# Altium project Passive_Sonar_Rev3.PrjPcb
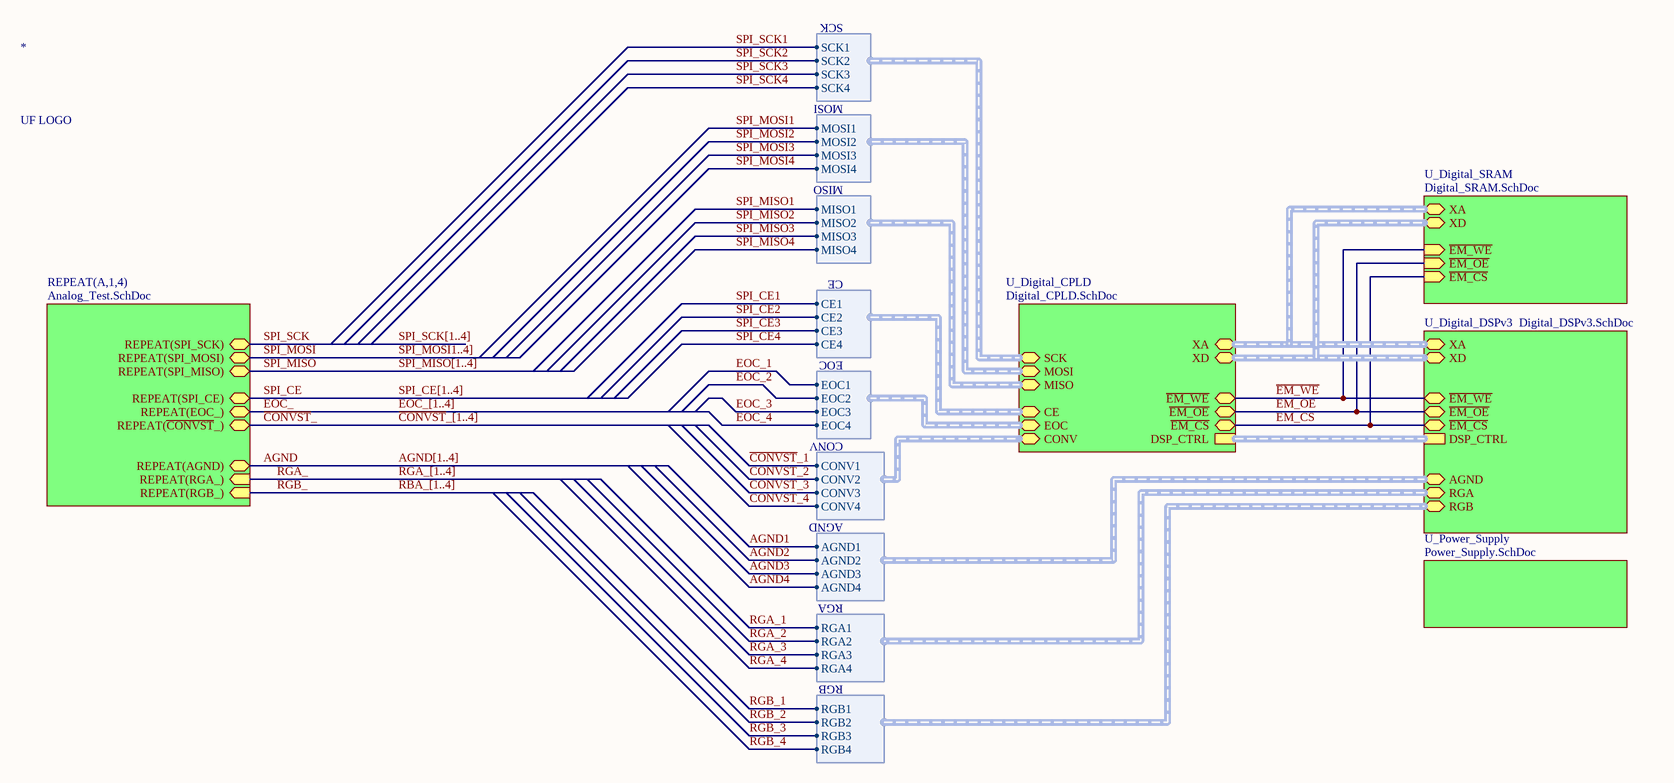
[diagram p0: Top_Level_3.SchDoc]
6 sheets, 245 parts. Net scope: hierarchical (ports join the sheet entries above them; power ports are global).
Board file: Board_Design.PcbDoc
Sheets:
  Top_Level_3.SchDoc
    A1 = Analog_Test.SchDoc
    A2 = Analog_Test.SchDoc
    A3 = Analog_Test.SchDoc
    A4 = Analog_Test.SchDoc
    U_Power_Supply = Power_Supply.SchDoc
    U_Digital_DSPv3 = Digital_DSPv3.SchDoc
    U_Digital_SRAM = Digital_SRAM.SchDoc
    U_Digital_CPLD = Digital_CPLD.SchDoc

## Sheet Top_Level_3.SchDoc
size 381 x 241 mm

### Parts
*  UF LOGO  [UF LOGO-1000]
MIL  MIL LOGO  [MIL LOGO - 500]  (value not drawn)

### Sub-sheets
REPEAT(A,1,4) = Analog_Test.SchDoc: REPEAT(RGA_) (in), REPEAT(RGB_) (in), REPEAT(SPI_SCK) (bidir), REPEAT(SPI_MISO) (bidir), REPEAT(SPI_CE) (bidir), REPEAT(~{CONVST}_) (bidir), REPEAT(EOC_) (bidir), REPEAT(AGND) (bidir), REPEAT(SPI_MOSI) (bidir)
U_Digital_CPLD = Digital_CPLD.SchDoc: ~{EM_OE} (bidir), ~{EM_CS} (bidir), ~{EM_WE} (bidir), DSP_CTRL (harness DSP_CTRL), XA (harness XA), XD (harness XD), SCK (harness SCK), MOSI (harness MOSI), MISO (harness MISO), CE (harness CE), EOC (harness EOC), CONV (harness CONV)
U_Digital_DSPv3 = Digital_DSPv3.SchDoc: ~{EM_WE} (bidir), ~{EM_OE} (bidir), ~{EM_CS} (bidir), DSP_CTRL (harness DSP_CTRL), XA (harness XA), XD (harness XD), AGND (harness AGND), RGA (harness RGA), RGB (harness RGB)
U_Digital_SRAM = Digital_SRAM.SchDoc: ~{EM_CS} (in), ~{EM_WE} (in), ~{EM_OE} (in), XD (harness XD), XA (harness XA)
U_Power_Supply = Power_Supply.SchDoc: no entries

### Harnesses
SCK: SCK1, SCK2, SCK3, SCK4
MOSI: MOSI1, MOSI2, MOSI3, MOSI4
MISO: MISO1, MISO2, MISO3, MISO4
CE: CE1, CE2, CE3, CE4
EOC: EOC1, EOC2, EOC3, EOC4
CONV: CONV1, CONV2, CONV3, CONV4
AGND: AGND1, AGND2, AGND3, AGND4
RGA: RGA1, RGA2, RGA3, RGA4
RGB: RGB1, RGB2, RGB3, RGB4

### Nets
AGND: sheet REPEAT(A,1,4)/REPEAT(AGND)
~{CONVST}_: sheet REPEAT(A,1,4)/REPEAT(~{CONVST}_)
~{EM_CS}: sheet U_Digital_DSPv3/~{EM_CS}, sheet U_Digital_SRAM/~{EM_CS}, sheet U_Digital_CPLD/~{EM_CS}
~{EM_OE}: sheet U_Digital_DSPv3/~{EM_OE}, sheet U_Digital_SRAM/~{EM_OE}, sheet U_Digital_CPLD/~{EM_OE}
~{EM_WE}: sheet U_Digital_DSPv3/~{EM_WE}, sheet U_Digital_SRAM/~{EM_WE}, sheet U_Digital_CPLD/~{EM_WE}
EOC_: sheet REPEAT(A,1,4)/REPEAT(EOC_)
RGA_: sheet REPEAT(A,1,4)/REPEAT(RGA_)
RGB_: sheet REPEAT(A,1,4)/REPEAT(RGB_)
SPI_CE: sheet REPEAT(A,1,4)/REPEAT(SPI_CE)
SPI_MISO: sheet REPEAT(A,1,4)/REPEAT(SPI_MISO)
SPI_MOSI: sheet REPEAT(A,1,4)/REPEAT(SPI_MOSI)
SPI_SCK: sheet REPEAT(A,1,4)/REPEAT(SPI_SCK)

### Buses and harness runs
bus AGND[1..4]
bus EOC_[1..4]
bus RBA_[1..4]
bus RGA_[1..4]
bus SPI_CE[1..4]
bus SPI_MISO[1..4]
bus SPI_MOSI1..4]
bus SPI_SCK[1..4]
bus ~{CONVST}_[1..4]
harness sheet U_Digital_CPLD/DSP_CTRL = sheet U_Digital_DSPv3/DSP_CTRL
harness sheet U_Digital_CPLD/XA = sheet U_Digital_DSPv3/XA = sheet U_Digital_SRAM/XA
harness sheet U_Digital_CPLD/XD = sheet U_Digital_DSPv3/XD = sheet U_Digital_SRAM/XD

## Sheet Analog_Test.SchDoc
size A
Used 4 times, as channels A1, A2, A3, A4. Parts and nets are listed once, with the designators drawn on the sheet.
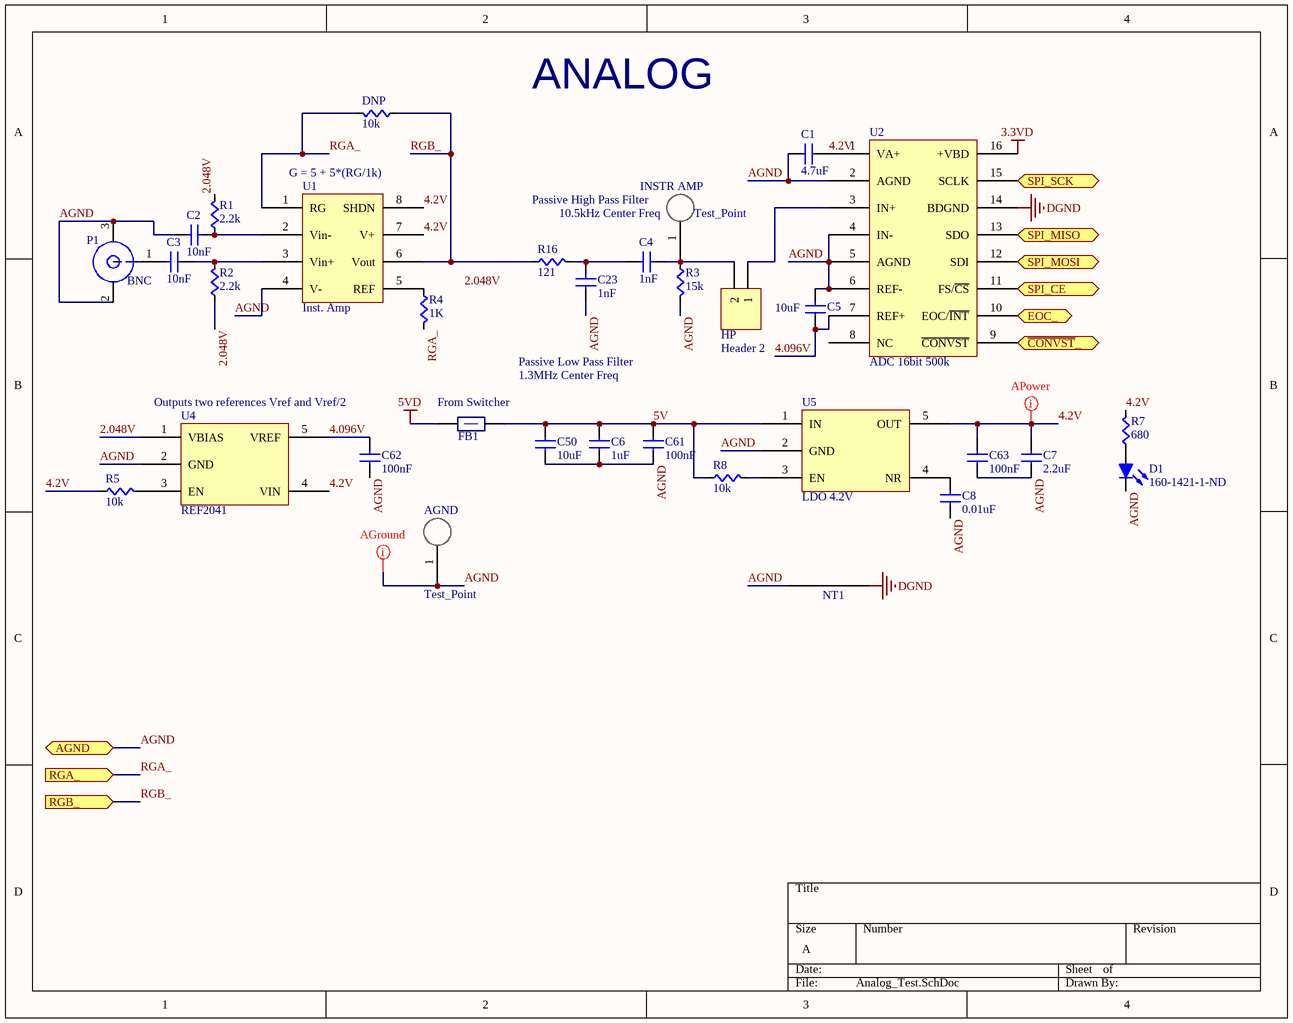
[diagram p1: Analog_Test.SchDoc]

### Parts
AGND  Test_Point  [TP]
C1  value 4.7uF  [CAPC0603]  (hidden comment: Cap)
C2  value 10nF  [CAPC0603]  (hidden comment: Cap)
C3  value 10nF  [CAPC0603]  (hidden comment: Cap)
C4  value 1nF  [CAPC0603]  (hidden comment: Cap)
C5  value 10uF  [CAPC0603]  (hidden comment: Cap)
C6  value 1uF  [CAPC0603]  (hidden comment: Cap)
C7  value 2.2uF  [CAPC0603]  (hidden comment: Cap)
C8  value 0.01uF  [CAPC0603]  (hidden comment: Cap)
C23  value 1nF  [CAPC0603]  (hidden comment: Cap)
C50  value 10uF  [CAPC0603]  (hidden comment: Cap)
C61  value 100nF  [CAPC0603]  (hidden comment: Cap)
C62  value 100nF  [CAPC0603]  (hidden comment: Cap)
C63  value 100nF  [CAPC0603]  (hidden comment: Cap)
D1  Supplier Part Number: 160-1421-1-ND  [LED0805-RED]  (hidden comment: LED-RED)
DNP  value 10k  [RES0603]  (hidden comment: Res)
FB1  FBead  [RES0603]  (value not drawn)
HP  Header 2  [HDR1X2]
INSTR_AMP  Test_Point  [TP]
NT1  NetTie  [NT_5mil]  (value not drawn)  (net tie, no BOM)
P1  BNC  [BNC Connector]
R1  value 2.2k  [RES0603]  (hidden comment: Res)
R2  value 2.2k  [RES0603]  (hidden comment: Res)
R3  value 15k  [RES0603]  (hidden comment: Res)
R4  value 1K  [RES0603]  (hidden comment: Res)
R5  value 10k  [RES0603]  (hidden comment: Res)
R7  value 680  [RES0603]  (hidden comment: Res)
R8  value 10k  [RES0603]  (hidden comment: Res)
R16  value 121  [RES0603]  (hidden comment: Res)
U1  Inst. Amp  [TSSOP-8n]
U2  ADC 16bit 500k  [TSSOP-16pin]
U4  REF2041  [SOT23-5]
U5  LDO 4.2V  [sot23-5]

### Ports
AGND (bidir), EOC_ (bidir), RGA_ (in), RGB_ (in), SPI_CE (bidir), SPI_MISO (bidir), SPI_MOSI (bidir), SPI_SCK (bidir), ~{CONVST}_ (bidir)

### Nets
3.3VD: U2.16(+VBD)
5VD: FB1.1(A)
DGND: NT1.2 U2.14(BDGND)
2.048V: R1.1(A) R2.2(B) U4.1(VBIAS)
4.2V: C1.2(B) C7.2(B) C63.1(A) R5.2(B) R7.1(A) U1.7(V+) U1.8(SHDN) U2.1(VA+) U4.4(VIN) U5.5(OUT)
4.096V: C5.2(B) C62.1(A) U2.7(REF+) U4.5(VREF)
5V: C6.2(B) C50.1(A) C61.1(A) FB1.2(B) R8.2(B) U5.1(IN)
AGND: AGND.1 C1.1(A) C2.1(A) C5.1(A) C6.1(A) C7.1(A) C8.1(A) C23.1(A) C50.2(B) C61.2(B) C62.2(B) C63.2(B) D1.1(K) NT1.1 P1.2(GND) P1.3(GND) R3.1(A) U1.4(V-) U2.2(AGND) U2.4(IN-) U2.5(AGND) U2.6(REF-) U4.2(GND) U5.2(GND) ; port AGND
~{CONVST}_: U2.9(~{CONVST}) ; port ~{CONVST}_
EOC_: U2.10(EOC/~{INT}) ; port EOC_
RGA_: DNP.1(A) R4.1(A) U1.1(RG) ; port RGA_
RGB_: DNP.2(B) R16.2(B) U1.6(Vout) ; port RGB_
SPI_CE: U2.11(FS/~{CS}) ; port SPI_CE
SPI_MISO: U2.13(SDO) ; port SPI_MISO
SPI_MOSI: U2.12(SDI) ; port SPI_MOSI
SPI_SCK: U2.15(SCLK) ; port SPI_SCK
NetC2_2: C2.2(B) R1.2(B) U1.2(Vin-)
NetC3_1: C3.1(A) P1.1(Signal)
NetC3_2: C3.2(B) R2.1(A) U1.3(Vin+)
NetC4_1: C4.1(A) C23.2(B) R16.1(A)
NetC4_2: C4.2(B) HP.2 INSTR_AMP.1 R3.2(B)
NetC8_2: C8.2(B) U5.4(NR)
NetD1_2: D1.2(A) R7.2(B)
NetHP_1: HP.1 U2.3(IN+)
NetR4_2: R4.2(B) U1.5(REF)
NetR5_1: R5.1(A) U4.3(EN)
NetR8_1: R8.1(A) U5.3(EN)

Not connected (* = marked no-connect by the designer): U2 8(NC)

### Channels
A1: designators AGND=AGND_A1 C1=C1_A1 C2=C2_A1 C3=C3_A1 C4=C4_A1 C5=C5_A1 C6=C6_A1 C7=C7_A1 C8=C8_A1 C23=C23_A1 C50=C50_A1 C61=C61_A1 C62=C62_A1 C63=C63_A1 D1=D1_A1 DNP=DNP_A1 FB1=FB1_A1 HP=HP_A1 INSTR AMP=INSTR_AMP_A1 NT1=NT1_A1 P1=P1_A1 R1=R1_A1 R2=R2_A1 R3=R3_A1 R4=R4_A1 R5=R5_A1 R7=R7_A1 R8=R8_A1 R16=R16_A1 U1=U1_A1 U2=U2_A1 U4=U4_A1 U5=U5_A1; ports AGND=AGND EOC_=EOC_1 RGA_=RGA_ RGB_=RGB_ SPI_CE=SPI_CE1 SPI_MISO=SPI_MISO1 SPI_MOSI=SPI_MOSI1 SPI_SCK=SPI_SCK1 ~{CONVST}_=~{CONVST}_1
A2: designators AGND=AGND_A2 C1=C1_A2 C2=C2_A2 C3=C3_A2 C4=C4_A2 C5=C5_A2 C6=C6_A2 C7=C7_A2 C8=C8_A2 C23=C23_A2 C50=C50_A2 C61=C61_A2 C62=C62_A2 C63=C63_A2 D1=D1_A2 DNP=DNP_A2 FB1=FB1_A2 HP=HP_A2 INSTR AMP=INSTR_AMP_A2 NT1=NT1_A2 P1=P1_A2 R1=R1_A2 R2=R2_A2 R3=R3_A2 R4=R4_A2 R5=R5_A2 R7=R7_A2 R8=R8_A2 R16=R16_A2 U1=U1_A2 U2=U2_A2 U4=U4_A2 U5=U5_A2; ports AGND=AGND EOC_=EOC_2 RGA_=RGA_ RGB_=RGB_ SPI_CE=SPI_CE2 SPI_MISO=SPI_MISO2 SPI_MOSI=SPI_MOSI2 SPI_SCK=SPI_SCK2 ~{CONVST}_=~{CONVST}_2
A3: designators AGND=AGND_A3 C1=C1_A3 C2=C2_A3 C3=C3_A3 C4=C4_A3 C5=C5_A3 C6=C6_A3 C7=C7_A3 C8=C8_A3 C23=C23_A3 C50=C50_A3 C61=C61_A3 C62=C62_A3 C63=C63_A3 D1=D1_A3 DNP=DNP_A3 FB1=FB1_A3 HP=HP_A3 INSTR AMP=INSTR_AMP_A3 NT1=NT1_A3 P1=P1_A3 R1=R1_A3 R2=R2_A3 R3=R3_A3 R4=R4_A3 R5=R5_A3 R7=R7_A3 R8=R8_A3 R16=R16_A3 U1=U1_A3 U2=U2_A3 U4=U4_A3 U5=U5_A3; ports AGND=AGND EOC_=EOC_3 RGA_=RGA_ RGB_=RGB_ SPI_CE=SPI_CE3 SPI_MISO=SPI_MISO3 SPI_MOSI=SPI_MOSI3 SPI_SCK=SPI_SCK3 ~{CONVST}_=~{CONVST}_3
A4: designators AGND=AGND_A4 C1=C1_A4 C2=C2_A4 C3=C3_A4 C4=C4_A4 C5=C5_A4 C6=C6_A4 C7=C7_A4 C8=C8_A4 C23=C23_A4 C50=C50_A4 C61=C61_A4 C62=C62_A4 C63=C63_A4 D1=D1_A4 DNP=DNP_A4 FB1=FB1_A4 HP=HP_A4 INSTR AMP=INSTR_AMP_A4 NT1=NT1_A4 P1=P1_A4 R1=R1_A4 R2=R2_A4 R3=R3_A4 R4=R4_A4 R5=R5_A4 R7=R7_A4 R8=R8_A4 R16=R16_A4 U1=U1_A4 U2=U2_A4 U4=U4_A4 U5=U5_A4; ports AGND=AGND EOC_=EOC_4 RGA_=RGA_ RGB_=RGB_ SPI_CE=SPI_CE4 SPI_MISO=SPI_MISO4 SPI_MOSI=SPI_MOSI4 SPI_SCK=SPI_SCK4 ~{CONVST}_=~{CONVST}_4

### Layout directives
net class AGround: AGND
net class APower: 4.2V_A1

### Notes on the sheet
- ANALOG
- (near U1) G = 5 + 5*(RG/1k)
- (near INSTR_AMP) Passive High Pass Filter
- (near INSTR_AMP) 10.5kHz Center Freq
- Passive Low Pass Filter
- Outputs two references Vref and Vref/2
- (near FB1) From Switcher
- 1.3MHz Center Freq
- Labels drawn without touching a wire or pin: 2.048V

### Library data of the parts
AGND INSTR_AMP = Test_Point: TEST POINT PC COMPACT .063"D; Supplier 1: Digi-Key; Supplier Part Number 1: 5006K-ND
D1 = LED-RED: Light Emitting Diode - RED; Manufacturer Part Number: LTST-C171CKT; Manufacturer: Lite-On Inc; Voltage - Forward (Vf) Typ: 1.8V; Current - Test: 20mA; Millicandela Rating: 25mcd; Viewing Angle: 130°; Color: Red; Supplier: Digi-Key; Package / Case: 0805 (2012 Metric)
FB1 = FBead: Ferrite Bead; Supplier 1: Digi-Key; Supplier Part Number 1: 445-2988-1-ND
HP = Header 2: Header, 2-Pin; LatestRevisionDate: 17-Jul-2002; LatestRevisionNote: Re-released for DXP Platform.; Publisher: Altium Limited
NT1 = NetTie: Ties two nets together
P1 = BNC Connector: CONN BNC JACK R/A 50 OHM PCB; Suplier 1: Digi-Key; Supplier Part Number 1: WM5524-ND
U1 = INA331: IC OPAMP INSTR 2MHZ RRO 8VSSOP; Suplier Part Number 1: 296-12202-1-ND; Supplier 1: Digi-Key
U2 = ADC 16bit 500k: IC ADC 16BIT 500KSPS 16-TSSOP; Supplier 1: Digi-Key; Supplier Part Number 1: 296-19764-ND
U4 = REF2041: IC VREF SERIES 2.05V/4.096V 5SOT; Supplier 1: Digi-Key; Supplier Part Number 1: 296-38497-1-ND
U5 = LDO 4.2V 200mA: IC REG LDO 4.2V 0.2A 5SOT; Supplier 1: Digi-Key; Supplier Part Number 1: 296-32585-1-ND
C1-C8 C23 C50 C61-C63 = Cap: Supplier 1: Digi-Key; Supplier Part Number 1: 1276-1000-1-ND
DNP R1-R5 R7 R8 R16 = Res: Supplier 1: Digi-Key; Supplier Part Number 1: RMCF0603JT10K0CT-ND

## Sheet Power_Supply.SchDoc
size A
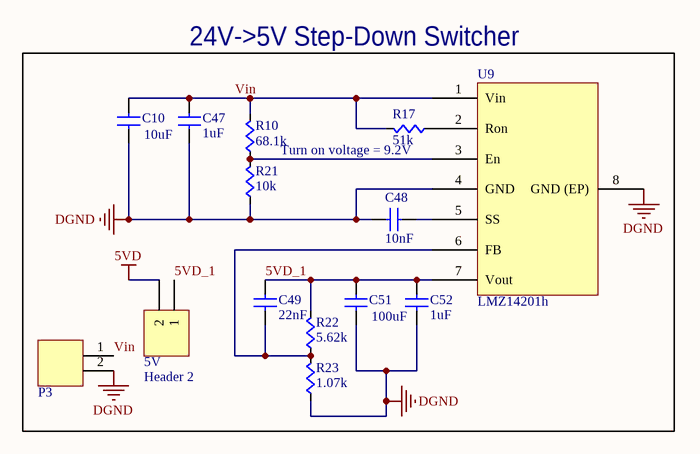
[diagram p2: Power_Supply.SchDoc]

### Parts
5V  Header 2  [HDR1X2]
C10  value 10uF  [CAP1210]  (hidden comment: CAP1210)
C47  value 1uF  [CAP1206]  (hidden comment: Cap1206)
C48  value 10nF  [CAPC0603]  (hidden comment: Cap)
C49  value 22nF  [CAPC0603]  (hidden comment: Cap)
C51  value 100uF  [CAP1210]  (hidden comment: CAP1210)
C52  value 1uF  [CAP1206]  (hidden comment: Cap1206)
P3  2-pin Horz Sherlock  [MOLEX-HDR-1X2-SHERLOCK-HORZ]  (value not drawn)
R10  value 68.1k  [RES0603]  (hidden comment: Res)
R17  value 51k  [RES0603]  (hidden comment: Res)
R21  value 10k  [RES0603]  (hidden comment: Res)
R22  value 5.62k  [RES0603]  (hidden comment: Res)
R23  value 1.07k  [RES0603]  (hidden comment: Res)
U9  LMZ14201h  [TO-PMOD-7]

### Nets
5VD: 5V.2
DGND: C10.2(B) C47.2(B) C48.1(A) C51.2(B) C52.2(B) P3.2 R21.2(B) R23.2(B) U9.4(GND) U9.8(GND_(EP))
5VD_1: 5V.1 C49.2(B) C51.1(A) C52.1(A) R22.1(A) U9.7(Vout)
Vin: C10.1(A) C47.1(A) P3.1 R10.1(A) R17.1(A) U9.1(Vin)
NetC48_2: C48.2(B) U9.5(SS)
NetC49_1: C49.1(A) R22.2(B) R23.1(A) U9.6(FB)
NetR10_2: R10.2(B) R21.1(A) U9.3(En)
NetR17_2: R17.2(B) U9.2(Ron)

### Notes on the sheet
- 24V->5V Step-Down Switcher
- (near R17) Turn on voltage = 9.2V

### Library data of the parts
5V = Header 2: Header, 2-Pin; LatestRevisionDate: 17-Jul-2002; LatestRevisionNote: Re-released for DXP Platform.; Publisher: Altium Limited
C10 C51 = CAP1210: CAP CER 10UF 50V 20% X5R 1210; Supplier 1: Digi-Key
  C10: Supplier Part Number 1: 587-2225-1-ND
  C51: Supplier Part Number 1: 587-1387-1-ND
C47 C52 = Cap1206: CAP CER 1UF 50V 10% X7R 1206; Supplier 1: Digi-Key; Supplier Part Number 1: 587-2230-1-ND
P3 = MOLEX-HDR-1x2-SHERLOCK_RA: Header, Molex, 2mm Pitch Sherlock Header, Single Row, Horizontal, 2 Circuits, Length 3.3mm,  0353630260; Manufacturer: Molex Inc; Manufacturer Part Number: 0353630260; Supplier Part Number 1: WM18931-ND; Supplier 1: Digi-Key
U9 = LMZ14201h: IC BUCK SYNC ADJ 1A TO-PMOD-7; Supplier 1: Digi-Key; Supplier Part Number 1: LMZ14201HTZX/NOPBCT-ND
C48 C49 = Cap: Supplier 1: Digi-Key; Supplier Part Number 1: 1276-1000-1-ND
R10 R17 R21-R23 = Res: Supplier 1: Digi-Key; Supplier Part Number 1: RMCF0603JT10K0CT-ND

## Sheet Digital_DSPv3.SchDoc
size 508 x 508 mm
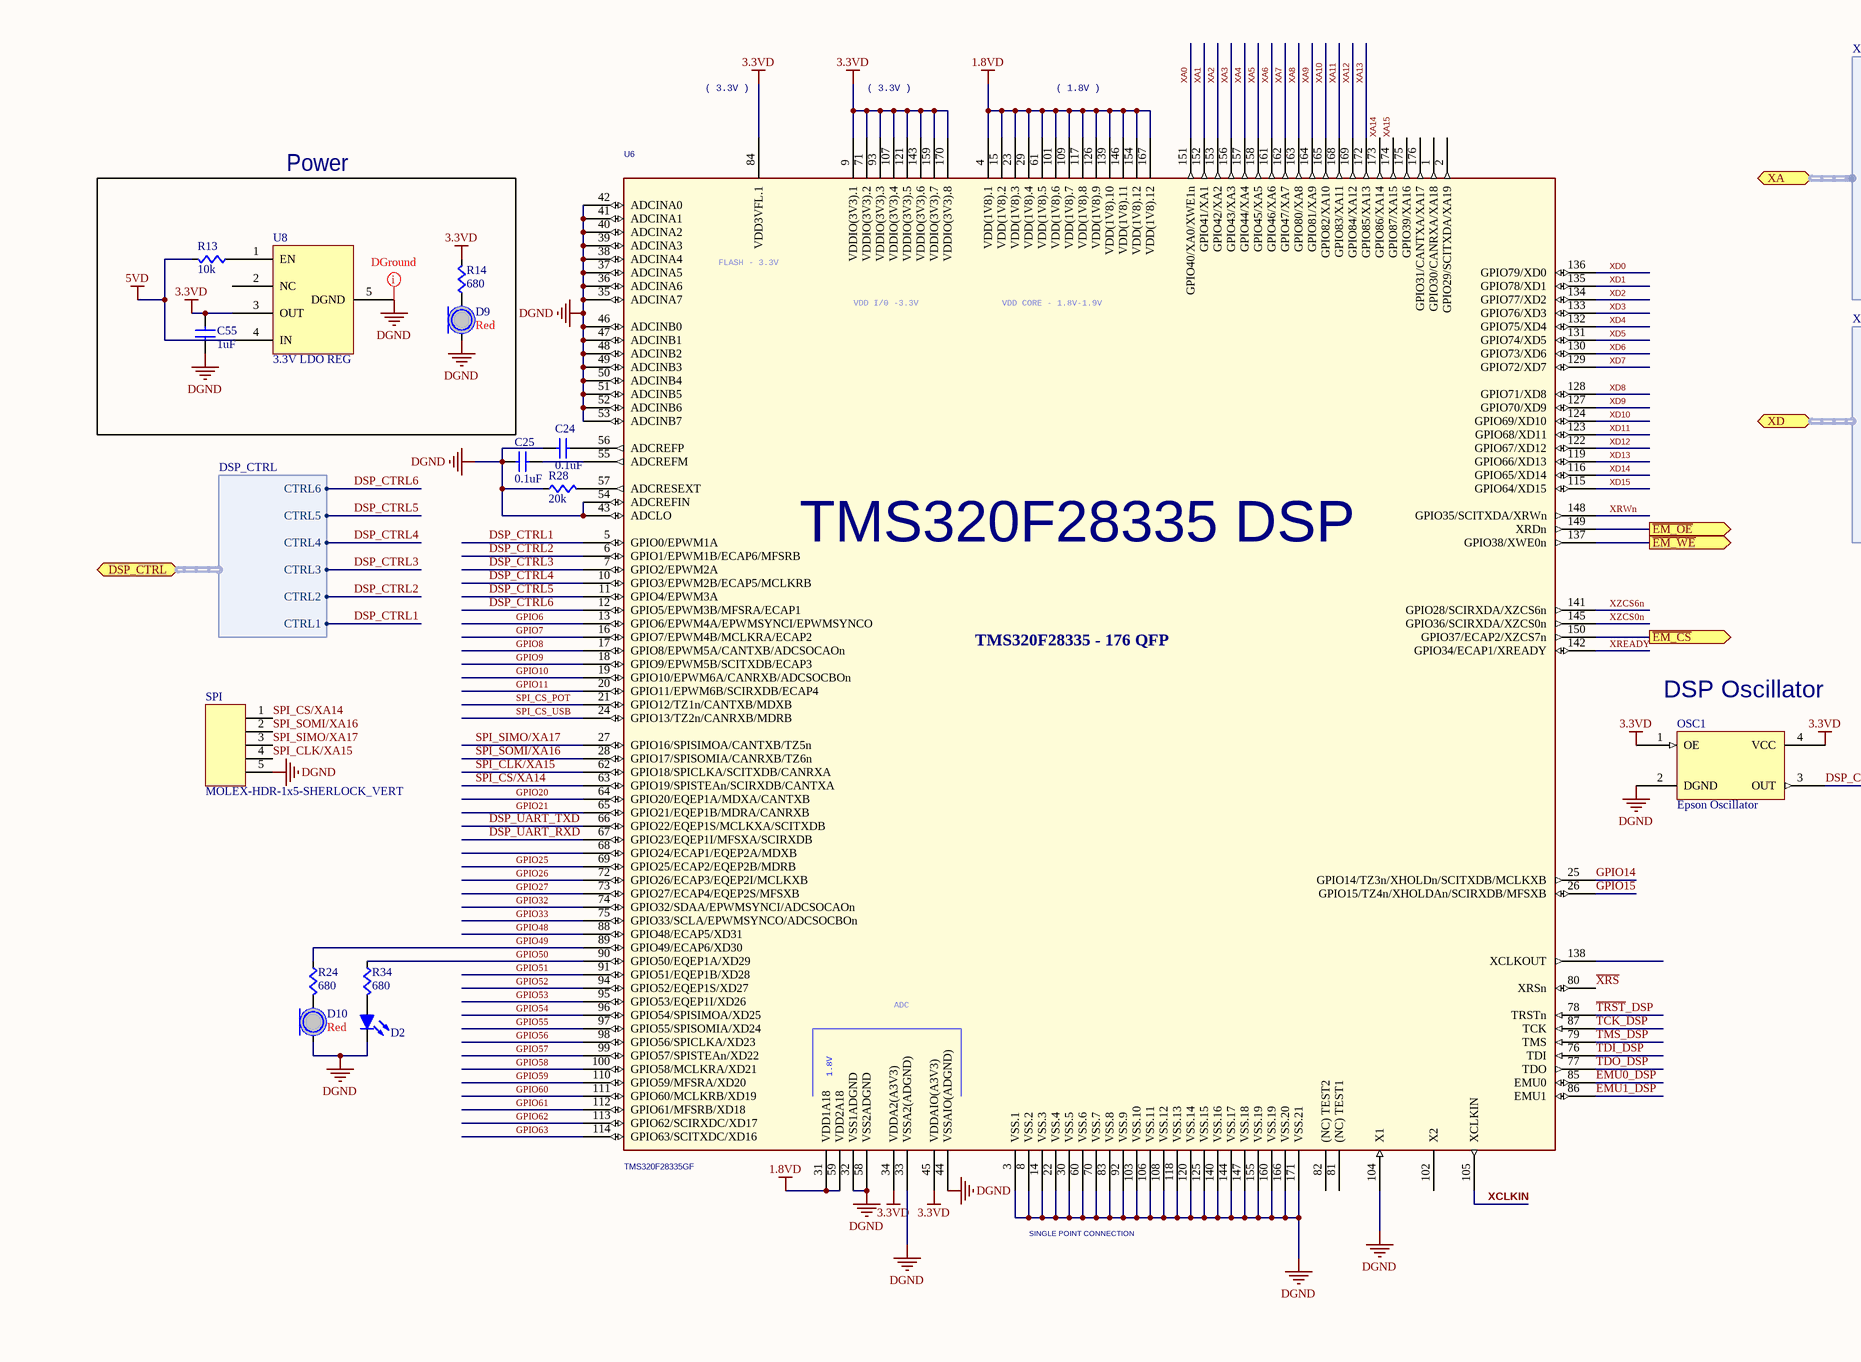
[diagram p3: Digital_DSPv3.SchDoc, top left]
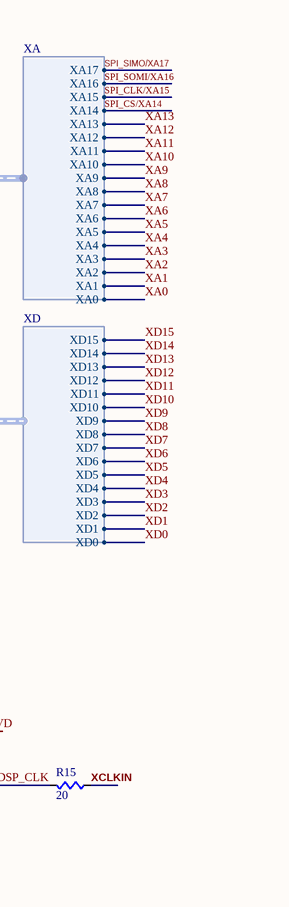
[diagram p4: Digital_DSPv3.SchDoc, top right]
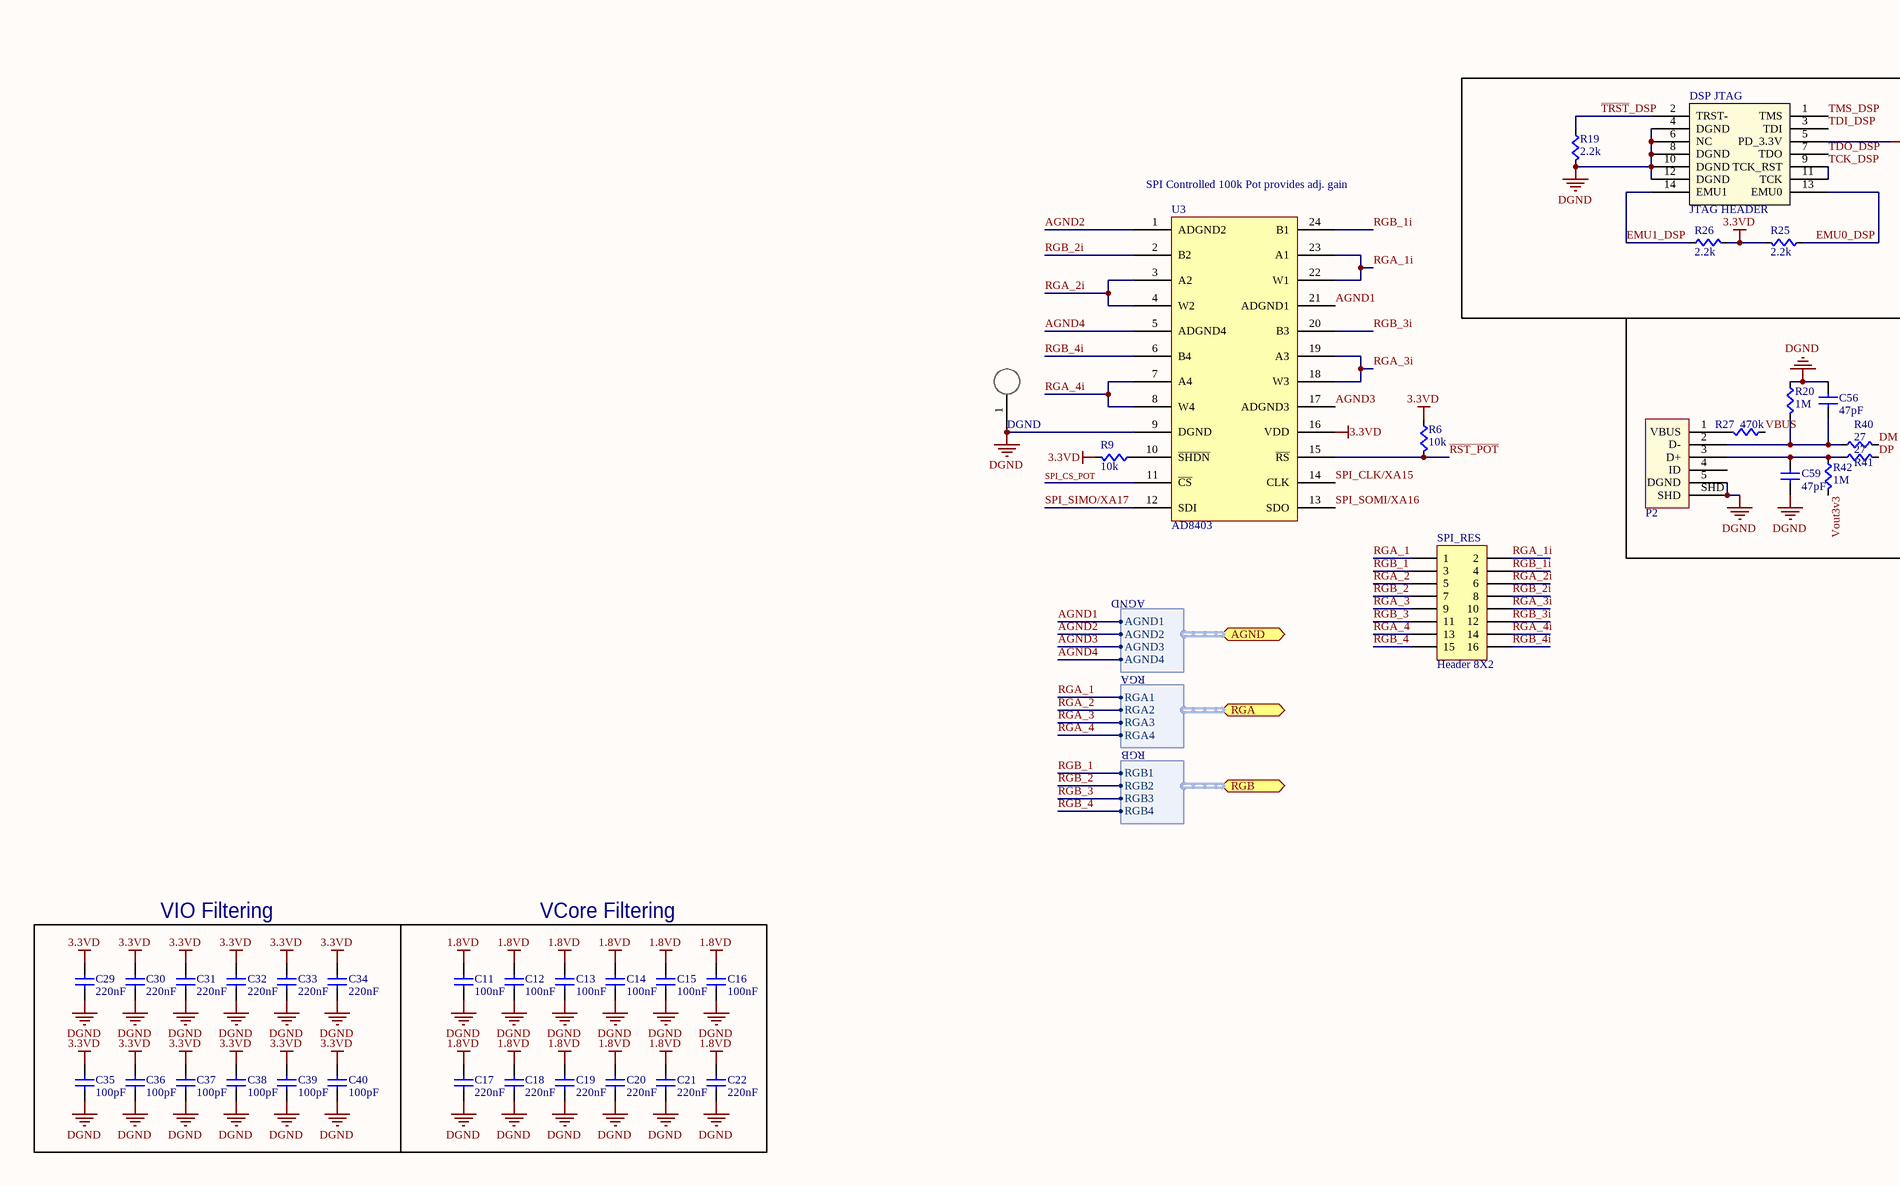
[diagram p5: Digital_DSPv3.SchDoc, bottom left]
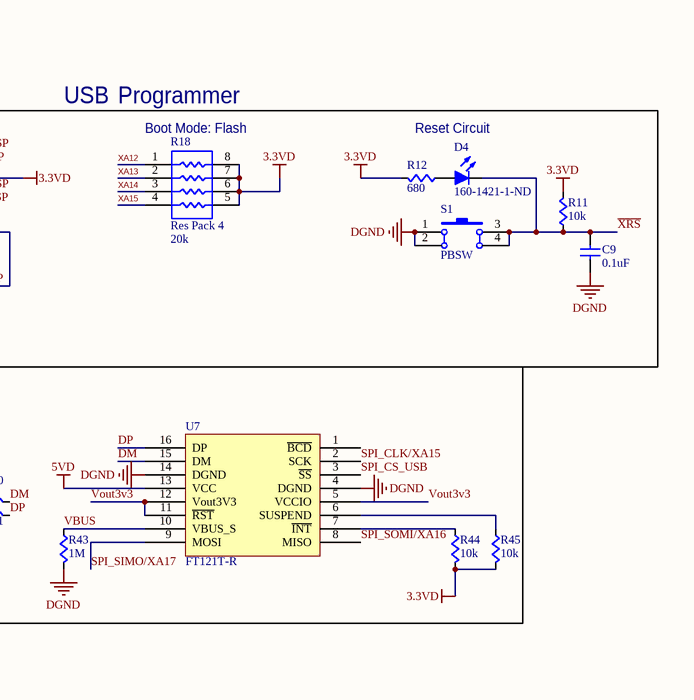
[diagram p6: Digital_DSPv3.SchDoc, bottom right]

### Parts
C9  value 0.1uF  [CAPC0603]  (hidden comment: Cap)
C11  value 100nF  [CAPC0603]  (hidden comment: Cap)
C12  value 100nF  [CAPC0603]  (hidden comment: Cap)
C13  value 100nF  [CAPC0603]  (hidden comment: Cap)
C14  value 100nF  [CAPC0603]  (hidden comment: Cap)
C15  value 100nF  [CAPC0603]  (hidden comment: Cap)
C16  value 100nF  [CAPC0603]  (hidden comment: Cap)
C17  value 220nF  [CAPC0603]  (hidden comment: Cap)
C18  value 220nF  [CAPC0603]  (hidden comment: Cap)
C19  value 220nF  [CAPC0603]  (hidden comment: Cap)
C20  value 220nF  [CAPC0603]  (hidden comment: Cap)
C21  value 220nF  [CAPC0603]  (hidden comment: Cap)
C22  value 220nF  [CAPC0603]  (hidden comment: Cap)
C24  value 0.1uF  [CAPC0603]  (hidden comment: Cap1206)
C25  value 0.1uF  [CAPC0603]  (hidden comment: Cap1206)
C29  value 220nF  [CAPC0603]  (hidden comment: Cap)
C30  value 220nF  [CAPC0603]  (hidden comment: Cap)
C31  value 220nF  [CAPC0603]  (hidden comment: Cap)
C32  value 220nF  [CAPC0603]  (hidden comment: Cap)
C33  value 220nF  [CAPC0603]  (hidden comment: Cap)
C34  value 220nF  [CAPC0603]  (hidden comment: Cap)
C35  value 100pF  [CAPC0603]  (hidden comment: Cap)
C36  value 100pF  [CAPC0603]  (hidden comment: Cap)
C37  value 100pF  [CAPC0603]  (hidden comment: Cap)
C38  value 100pF  [CAPC0603]  (hidden comment: Cap)
C39  value 100pF  [CAPC0603]  (hidden comment: Cap)
C40  value 100pF  [CAPC0603]  (hidden comment: Cap)
C55  value 1uF  [CAPC0603]  (hidden comment: Cap1206)
C56  value 47pF  [CAPC0603]  (hidden comment: Cap1206)
C59  value 47pF  [CAPC0603]  (hidden comment: Cap1206)
D2  LED-RED  [LED0805-RED]  (value not drawn)
D4  Supplier Part Number: 160-1421-1-ND  [LED0805-RED]  (hidden comment: LED-RED)
D9  Color: Red  [LED0805]  (hidden comment: LED)
D10  Color: Red  [LED0805]  (hidden comment: LED)
DGND  Test_Point  [TP]  (value not drawn)
DSP_JTAG  JTAG HEADER  [JTAG HEADER - 14]
OSC1  Epson Oscillator  [Oscillator]
P2  USB Micro  [10118192-0001LF]  (value not drawn)
R6  value 10k  [RES0603]  (hidden comment: Res)
R9  value 10k  [RES0603]  (hidden comment: Res)
R11  value 10k  [RES0603]  (hidden comment: Res)
R12  value 680  [RES0603]  (hidden comment: Res)
R13  value 10k  [RES0603]  (hidden comment: Res)
R14  value 680  [RES0603]  (hidden comment: Res)
R15  value 20  [RES0603]  (hidden comment: Res)
R18  Res Pack 4  value 20k  [SO-8]
R19  value 2.2k  [RES0603]  (hidden comment: Res)
R20  value 1M  [RES0603]  (hidden comment: Res)
R24  value 680  [RES0603]  (hidden comment: Res)
R25  value 2.2k  [RES0603]  (hidden comment: Res)
R26  value 2.2k  [RES0603]  (hidden comment: Res)
R27  value 470k  [RES0603]  (hidden comment: Res)
R28  value 20k  [RES0603]  (hidden comment: Res)
R34  value 680  [RES0603]  (hidden comment: Res)
R40  value 27  [RES0603]  (hidden comment: Res)
R41  value 27  [RES0603]  (hidden comment: Res)
R42  value 1M  [RES0603]  (hidden comment: Res)
R43  value 1M  [RES0603]  (hidden comment: Res)
R44  value 10k  [RES0603]  (hidden comment: Res)
R45  value 10k  [RES0603]  (hidden comment: Res)
S1  PBSW  [PBSW]
SPI  MOLEX-HDR-1x5-SHERLOCK_VERT  [MOLEX-HDR-1X5-SHERLOCK-VERT]
SPI_RES  Header 8X2  [HDR2X8]
U3  AD8403  [SOIC-24n]
U6  TMS320F28335GF  [QFP176]
U7  FT121T-R  [TSSOP-16pin]
U8  3.3V LDO REG  [SOT223-8N]

### Blocks framed on the sheet
Power: C55 D9 R13 R14 U8
VIO Filtering: C29-C40
VCore Filtering: C11-C22

### Ports
AGND (harness AGND), DSP_CTRL (harness DSP_CTRL), RGA (harness RGA), RGB (harness RGB), XA (harness XA), XD (harness XD), ~{EM_CS} (out), ~{EM_OE} (out), ~{EM_WE} (out)

### Harnesses
DSP_CTRL: CTRL1, CTRL2, CTRL3, CTRL4, CTRL5, CTRL6
XA: XA17, XA16, XA15, XA14, XA13, XA12, XA11, XA10, XA9, XA8, XA7, XA6, XA5, XA4, XA3, XA2, XA1, XA0
XD: XD15, XD14, XD13, XD12, XD11, XD10, XD9, XD8, XD7, XD6, XD5, XD4, XD3, XD2, XD1, XD0
AGND: AGND1, AGND2, AGND3, AGND4
RGA: RGA1, RGA2, RGA3, RGA4
RGB: RGB1, RGB2, RGB3, RGB4

### Nets
1: S1.2(A')
1.8VD: C11.1(A) C12.1(A) C13.1(A) C14.1(A) C15.1(A) C16.1(A) C17.1(A) C18.1(A) C19.1(A) C20.1(A) C21.1(A) C22.1(A) U6.4(VDD(1V8).1) U6.15(VDD(1V8).2) U6.23(VDD(1V8).3) U6.29(VDD(1V8).4) U6.31(VDD1A18) U6.59(VDD2A18) U6.61(VDD(1V8).5) U6.101(VDD(1V8).6) U6.109(VDD(1V8).7) U6.117(VDD(1V8).8) U6.126(VDD(1V8).9) U6.139(VDD(1V8).10) U6.146(VDD(1V8).11) U6.154(VDD(1V8).12) U6.167(VDD(1V8).12)
3: S1.4(B')
3.3VD: C29.1(A) C30.1(A) C31.1(A) C32.1(A) C33.1(A) C34.1(A) C35.1(A) C36.1(A) C37.1(A) C38.1(A) C39.1(A) C40.1(A) C55.1(A) DSP_JTAG.5(PD_3.3V) OSC1.1(OE) OSC1.4(VCC) R6.2(B) R9.1(A) R11.1(A) R12.1(A) R14.1(A) R18.5 R18.6 R18.7 R18.8 R25.1(A) R26.1(A) R44.1(A) R45.1(A) U3.16(VDD) U6.9(VDDIO(3V3).1) U6.34(VDDA2(A3V3)) U6.45(VDDAIO(A3V3)) U6.71(VDDIO(3V3).2) U6.84(VDD3VFL.1) U6.93(VDDIO(3V3).3) U6.107(VDDIO(3V3).4) U6.121(VDDIO(3V3).5) U6.143(VDDIO(3V3).6) U6.159(VDDIO(3V3).7) U6.170(VDDIO(3V3).8) U8.3(OUT)
5VD: R13.1(A) U7.13(VCC) U8.4(IN)
DGND: C9.2(B) C11.2(B) C12.2(B) C13.2(B) C14.2(B) C15.2(B) C16.2(B) C17.2(B) C18.2(B) C19.2(B) C20.2(B) C21.2(B) C22.2(B) C24.1(A) C25.1(A) C29.2(B) C30.2(B) C31.2(B) C32.2(B) C33.2(B) C34.2(B) C35.2(B) C36.2(B) C37.2(B) C38.2(B) C39.2(B) C40.2(B) C55.2(B) C56.1(A) C59.2(B) D2.1(K) D9.C D10.C DGND.1 DSP_JTAG.4(DGND) DSP_JTAG.6(NC) DSP_JTAG.8(DGND) DSP_JTAG.10(DGND) DSP_JTAG.12(DGND) OSC1.2(DGND) P2.5(DGND) P2.SHD R19.1(A) R20.2(B) R28.2(B) R43.1(A) S1.1(A) S1.2(A') SPI.5 U3.9(DGND) U6.3(VSS.1) U6.8(VSS.2) U6.14(VSS.3) U6.22(VSS.4) U6.30(VSS.5) U6.32(VSS1ADGND) U6.33(VSSA2(ADGND)) U6.35(ADCINA7) U6.36(ADCINA6) U6.37(ADCINA5) U6.38(ADCINA4) U6.39(ADCINA3) U6.40(ADCINA2) U6.41(ADCINA1) U6.42(ADCINA0) U6.43(ADCLO) U6.44(VSSAIO(ADGND)) U6.46(ADCINB0) U6.47(ADCINB1) U6.48(ADCINB2) U6.49(ADCINB3) U6.50(ADCINB4) U6.51(ADCINB5) U6.52(ADCINB6) U6.53(ADCINB7) U6.54(ADCREFIN) U6.58(VSS2ADGND) U6.60(VSS.6) U6.70(VSS.7) U6.83(VSS.8) U6.92(VSS.9) U6.103(VSS.10) U6.104(X1) U6.106(VSS.11) U6.108(VSS.12) U6.118(VSS.13) U6.120(VSS.14) U6.125(VSS.15) U6.140(VSS.16) U6.144(VSS.17) U6.147(VSS.18) U6.155(VSS.19) U6.160(VSS.19) U6.166(VSS.20) U6.171(VSS.21) U7.4(DGND) U7.14(DGND) U8.5(DGND)
AGND1: U3.21(ADGND1) ; port AGND.AGND1  [project net AGND]
AGND2: U3.1(ADGND2) ; port AGND.AGND2  [project net AGND]
AGND3: U3.17(ADGND3) ; port AGND.AGND3  [project net AGND]
AGND4: U3.5(ADGND4) ; port AGND.AGND4  [project net AGND]
DM: R40.1(A) U7.15(DM)
DP: R41.1(A) U7.16(DP)
DSP_CLK: OSC1.3(OUT) R15.1(A)
DSP_CTRL1: U6.5(GPIO0/EPWM1A) ; port DSP_CTRL.CTRL1
DSP_CTRL2: U6.6(GPIO1/EPWM1B/ECAP6/MFSRB) ; port DSP_CTRL.CTRL2
DSP_CTRL3: U6.7(GPIO2/EPWM2A) ; port DSP_CTRL.CTRL3
DSP_CTRL4: U6.10(GPIO3/EPWM2B/ECAP5/MCLKRB) ; port DSP_CTRL.CTRL4
DSP_CTRL5: U6.11(GPIO4/EPWM3A) ; port DSP_CTRL.CTRL5
DSP_CTRL6: U6.12(GPIO5/EPWM3B/MFSRA/ECAP1) ; port DSP_CTRL.CTRL6
DSP_UART_RXD: U6.67(GPIO23/EQEP1I/MFSXA/SCIRXDB)
DSP_UART_TXD: U6.66(GPIO22/EQEP1S/MCLKXA/SCITXDB)
~{EM_CS}: U6.150(GPIO37/ECAP2/XZCS7n) ; port ~{EM_CS}
~{EM_OE}: U6.149(XRDn) ; port ~{EM_OE}
~{EM_WE}: U6.137(GPIO38/XWE0n) ; port ~{EM_WE}
EMU0_DSP: DSP_JTAG.13(EMU0) R25.2(B) U6.85(EMU0)
EMU1_DSP: DSP_JTAG.14(EMU1) R26.2(B) U6.86(EMU1)
GPIO6: U6.13(GPIO6/EPWM4A/EPWMSYNCI/EPWMSYNCO)
GPIO7: U6.16(GPIO7/EPWM4B/MCLKRA/ECAP2)
GPIO8: U6.17(GPIO8/EPWM5A/CANTXB/ADCSOCAOn)
GPIO9: U6.18(GPIO9/EPWM5B/SCITXDB/ECAP3)
GPIO10: U6.19(GPIO10/EPWM6A/CANRXB/ADCSOCBOn)
GPIO11: U6.20(GPIO11/EPWM6B/SCIRXDB/ECAP4)
GPIO14: U6.25(GPIO14/TZ3n/XHOLDn/SCITXDB/MCLKXB)
GPIO15: U6.26(GPIO15/TZ4n/XHOLDAn/SCIRXDB/MFSXB)
GPIO20: U6.64(GPIO20/EQEP1A/MDXA/CANTXB)
GPIO21: U6.65(GPIO21/EQEP1B/MDRA/CANRXB)
GPIO25: U6.69(GPIO25/ECAP2/EQEP2B/MDRB)
GPIO26: U6.72(GPIO26/ECAP3/EQEP2I/MCLKXB)
GPIO27: U6.73(GPIO27/ECAP4/EQEP2S/MFSXB)
GPIO32: U6.74(GPIO32/SDAA/EPWMSYNCI/ADCSOCAOn)
GPIO33: U6.75(GPIO33/SCLA/EPWMSYNCO/ADCSOCBOn)
GPIO48: U6.88(GPIO48/ECAP5/XD31)
GPIO49: R24.2(B) U6.89(GPIO49/ECAP6/XD30)
GPIO50: R34.2(B) U6.90(GPIO50/EQEP1A/XD29)
GPIO51: U6.91(GPIO51/EQEP1B/XD28)
GPIO52: U6.94(GPIO52/EQEP1S/XD27)
GPIO53: U6.95(GPIO53/EQEP1I/XD26)
GPIO54: U6.96(GPIO54/SPISIMOA/XD25)
GPIO55: U6.97(GPIO55/SPISOMIA/XD24)
GPIO56: U6.98(GPIO56/SPICLKA/XD23)
GPIO57: U6.99(GPIO57/SPISTEAn/XD22)
GPIO58: U6.100(GPIO58/MCLKRA/XD21)
GPIO59: U6.110(GPIO59/MFSRA/XD20)
GPIO60: U6.111(GPIO60/MCLKRB/XD19)
GPIO61: U6.112(GPIO61/MFSRB/XD18)
GPIO62: U6.113(GPIO62/SCIRXDC/XD17)
GPIO63: U6.114(GPIO63/SCITXDC/XD16)
~{RST_POT}: R6.1(A) U3.15(~{RS})
RGA_1: SPI_RES.1 ; port RGA.RGA1  [project net RGA_]
RGA_1i: SPI_RES.2 U3.22(W1) U3.23(A1)
RGA_2: SPI_RES.5 ; port RGA.RGA2  [project net RGA_]
RGA_2i: SPI_RES.6 U3.3(A2) U3.4(W2)
RGA_3: SPI_RES.9 ; port RGA.RGA3  [project net RGA_]
RGA_3i: SPI_RES.10 U3.18(W3) U3.19(A3)
RGA_4: SPI_RES.13 ; port RGA.RGA4  [project net RGA_]
RGA_4i: SPI_RES.14 U3.7(A4) U3.8(W4)
RGB_1: SPI_RES.3 ; port RGB.RGB1  [project net RGB_]
RGB_1i: SPI_RES.4 U3.24(B1)
RGB_2: SPI_RES.7 ; port RGB.RGB2  [project net RGB_]
RGB_2i: SPI_RES.8 U3.2(B2)
RGB_3: SPI_RES.11 ; port RGB.RGB3  [project net RGB_]
RGB_3i: SPI_RES.12 U3.20(B3)
RGB_4: SPI_RES.15 ; port RGB.RGB4  [project net RGB_]
RGB_4i: SPI_RES.16 U3.6(B4)
SPI_CLK/XA15: SPI.4 U3.14(CLK) U6.62(GPIO18/SPICLKA/SCITXDB/CANRXA) U7.2(SCK) ; port XA.XA15
SPI_CS/XA14: SPI.1 U6.63(GPIO19/SPISTEAn/SCIRXDB/CANTXA) ; port XA.XA14
SPI_CS_POT: U3.11(~{CS}) U6.21(GPIO12/TZ1n/CANTXB/MDXB)
SPI_CS_USB: U6.24(GPIO13/TZ2n/CANRXB/MDRB) U7.3(~{SS})
SPI_SIMO/XA17: SPI.3 U3.12(SDI) U6.27(GPIO16/SPISIMOA/CANTXB/TZ5n) U7.9(MOSI) ; port XA.XA17
SPI_SOMI/XA16: SPI.2 U3.13(SDO) U6.28(GPIO17/SPISOMIA/CANRXB/TZ6n) U7.8(MISO) ; port XA.XA16
~{TRST}_DSP: DSP_JTAG.2(TRST-) R19.2(B) U6.78(TRSTn)
TCK_DSP: DSP_JTAG.9(TCK_RST) DSP_JTAG.11(TCK) U6.87(TCK)
TDI_DSP: DSP_JTAG.3(TDI) U6.76(TDI)
TDO_DSP: DSP_JTAG.7(TDO) U6.77(TDO)
TMS_DSP: DSP_JTAG.1(TMS) U6.79(TMS)
VBUS: R27.2(B) R43.2(B) U7.10(VBUS_S)
Vout3v3: R42.1(A) U7.5(VCCIO) U7.11(~{RST}) U7.12(Vout3V3)
~{XRS}: C9.1(A) D4.1(K) R11.2(B) S1.3(B) S1.4(B') U6.80(XRSn)
XA0: U6.151(GPIO40/XA0/XWE1n) ; port XA.XA0
XA1: U6.152(GPIO41/XA1) ; port XA.XA1
XA2: U6.153(GPIO42/XA2) ; port XA.XA2
XA3: U6.156(GPIO43/XA3) ; port XA.XA3
XA4: U6.157(GPIO44/XA4) ; port XA.XA4
XA5: U6.158(GPIO45/XA5) ; port XA.XA5
XA6: U6.161(GPIO46/XA6) ; port XA.XA6
XA7: U6.162(GPIO47/XA7) ; port XA.XA7
XA8: U6.163(GPIO80/XA8) ; port XA.XA8
XA9: U6.164(GPIO81/XA9) ; port XA.XA9
XA10: U6.165(GPIO82/XA10) ; port XA.XA10
XA11: U6.168(GPIO83/XA11) ; port XA.XA11
XA12: R18.1 U6.169(GPIO84/XA12) ; port XA.XA12
XA13: R18.2 U6.172(GPIO85/XA13) ; port XA.XA13
XA14: R18.3 U6.173(GPIO86/XA14)
XA15: R18.4 U6.174(GPIO87/XA15)
XCLKIN: R15.2(B) U6.105(XCLKIN)
XD0: U6.136(GPIO79/XD0) ; port XD.XD0
XD1: U6.135(GPIO78/XD1) ; port XD.XD1
XD2: U6.134(GPIO77/XD2) ; port XD.XD2
XD3: U6.133(GPIO76/XD3) ; port XD.XD3
XD4: U6.132(GPIO75/XD4) ; port XD.XD4
XD5: U6.131(GPIO74/XD5) ; port XD.XD5
XD6: U6.130(GPIO73/XD6) ; port XD.XD6
XD7: U6.129(GPIO72/XD7) ; port XD.XD7
XD8: U6.128(GPIO71/XD8) ; port XD.XD8
XD9: U6.127(GPIO70/XD9) ; port XD.XD9
XD10: U6.124(GPIO69/XD10) ; port XD.XD10
XD11: U6.123(GPIO68/XD11) ; port XD.XD11
XD12: U6.122(GPIO67/XD12) ; port XD.XD12
XD13: U6.119(GPIO66/XD13) ; port XD.XD13
XD14: U6.116(GPIO65/XD14) ; port XD.XD14
XD15: U6.115(GPIO64/XD15) ; port XD.XD15
XREADY: U6.142(GPIO34/ECAP1/XREADY)
XRWn: U6.148(GPIO35/SCITXDA/XRWn)
XZCS0n: U6.145(GPIO36/SCIRXDA/XZCS0n)
XZCS6n: U6.141(GPIO28/SCIRXDA/XZCS6n)
NetC24_2: C24.2(B) U6.56(ADCREFP)
NetC25_2: C25.2(B) U6.55(ADCREFM)
NetC56_2: C56.2(B) P2.2(D-) R20.1(A) R40.2(B)
NetC59_1: C59.1(A) P2.3(D+) R41.2(B) R42.2(B)
NetD2_2: D2.2(A) R34.1(A)
NetD4_2: D4.2(A) R12.2(B)
NetD9_A: D9.A R14.2(B)
NetD10_A: D10.A R24.1(A)
NetP2_1: P2.1(VBUS) R27.1(A)
NetR9_2: R9.2(B) U3.10(~{SHDN})
NetR13_2: R13.2(B) U8.1(EN)
NetR28_1: R28.1(A) U6.57(ADCRESEXT)
NetR44_2: R44.2(B) U7.7(~{INT})
NetR45_2: R45.2(B) U7.6(SUSPEND)

Not connected (* = marked no-connect by the designer): P2 4(ID); U6 1(GPIO30/CANRXA/XA18) 2(GPIO29/SCITXDA/XA19) 68(GPIO24/ECAP1/EQEP2A/MDXB) 81((NC)_TEST1) 82((NC)_TEST2) 102(X2) 138(XCLKOUT) 175(GPIO39/XA16) 176(GPIO31/CANTXA/XA17); U7 1(~{BCD}); U8 2(NC)

### Layout directives
net class DGround: DGND

### Notes on the sheet
- ( 3.3V )
- ( 1.8V )
- (near U6) TMS320F28335 DSP
- (near OSC1) DSP Oscillator
- SINGLE POINT CONNECTION
- USB
- Programmer
- (near R18) Boot Mode: Flash
- Reset Circuit
- (near U3) SPI Controlled 100k Pot provides adj. gain
- (in symbol TMS320F283XXPGF_23) FLASH - 3.3V; VDD I/0 -3.3V; VDD CORE - 1.8V-1.9V; TMS320F28335 - 176 QFP; ADC; 1.8V

### Library data of the parts
C24 C25 C55 C56 C59 = Cap1206: CAP CER 1UF 50V 10% X7R 1206; Supplier 1: Digi-Key; Supplier Part Number 1: 587-2230-1-ND
D2 D4 = LED-RED: as D1 on sheet Analog_Test; Color: Red; Supplier: Digi-Key; Package / Case: 0805 (2012 Metric)
  D2: Supplier Part Number: 160-1421-1-ND
DGND = Test_Point: TEST POINT PC COMPACT .063"D; Supplier 1: Digi-Key; Supplier Part Number 1: 5006K-ND
DSP_JTAG = JTAG-TI_14: 14 Pin JTAG Header
OSC1 = Oscillator: 15Mhz Epson Clock; Digikey #: SE2826CT-ND
P2 = USB Micro: USB Mini B Metal Shield SMT; Supplier 1: Digi-Key; Supplier Part Number 1: 609-4613-1-ND
R18 = Res Pack 4: 4 Isolated Resistor Network; Published: 24-Mar-1999; LatestRevisionDate: 17-Jul-2002; LatestRevisionNote: Re-released for DXP Platform.; PackageReference: SO-16; Publisher: Altium Limited; Digikey #: YC164J-20KCT-ND
S1 = SW-PB: Push Button Switch; Manufacturer: Panasonic Electronic Components; Manufacturer Part Number: EVQ-9P105M; Outline: 6.10mm x 6.00mm; Actuator Orientation: Top Actuated; Actuator Height off PCB, from Pins: 5.00mm; Published: 24-Mar-1999; LatestRevisionDate: 17-Jul-2002; LatestRevisionNote: Re-released for DXP Platform.; PackageReference: SPST-2; Publisher: Altium Limited; PackageDescription: Switch; 2 Leads; Supplier: Digi-Key; Supplier Part Number: P13586SCT-ND
SPI = MOLEX-HDR-1x5-SHERLOCK_VERT: Header, Molex, 2mm Pitch Sherlock Header, Single Row, Vertical, 5 Circuits, Length 3.3mm, 0353620550; Manufacturer Part Number: *; Order Part Number: *
SPI_RES = Header 8X2: Header, 8-Pin, Dual row; LatestRevisionDate: 17-Jul-2002; LatestRevisionNote: Re-released for DXP Platform.; Publisher: Altium Limited
U3 = AD8403: IC POT DGTL 8BIT 100K 4CH 24SOIC; Supplier 1: Digi-Key; Supplier Part Number 1: AD8403ARZ100-ND
U6 = TMS320F283XXPGF_23: Texas Instruments F28335; Digikey #: 296-23660-ND
U7 = FT121T-R: IC USB CONTROLLER SPI 16-TSSOP; Supplier 1: Digi-Key; Supplier Part Number 1: 768-1167-1-ND
U8 = LP38691: IC REG LDO 3.3V 0.5A SOT223-5; Supplier 1: Digi-Key; Supplier Part Number 1: LP38693MP-3.3/NOPBCT-ND
C9 C11-C22 C29-C40 = Cap: Supplier 1: Digi-Key; Supplier Part Number 1: 1276-1000-1-ND
D9 D10 = LED: Supplier 1: Digi-Key; Supplier Part Number 1: 754-1122-1-ND
R6 R9 R11-R15 R19 R20 R24-R28 R34 R40-R45 = Res: Supplier 1: Digi-Key; Supplier Part Number 1: RMCF0603JT10K0CT-ND

## Sheet Digital_SRAM.SchDoc
size A
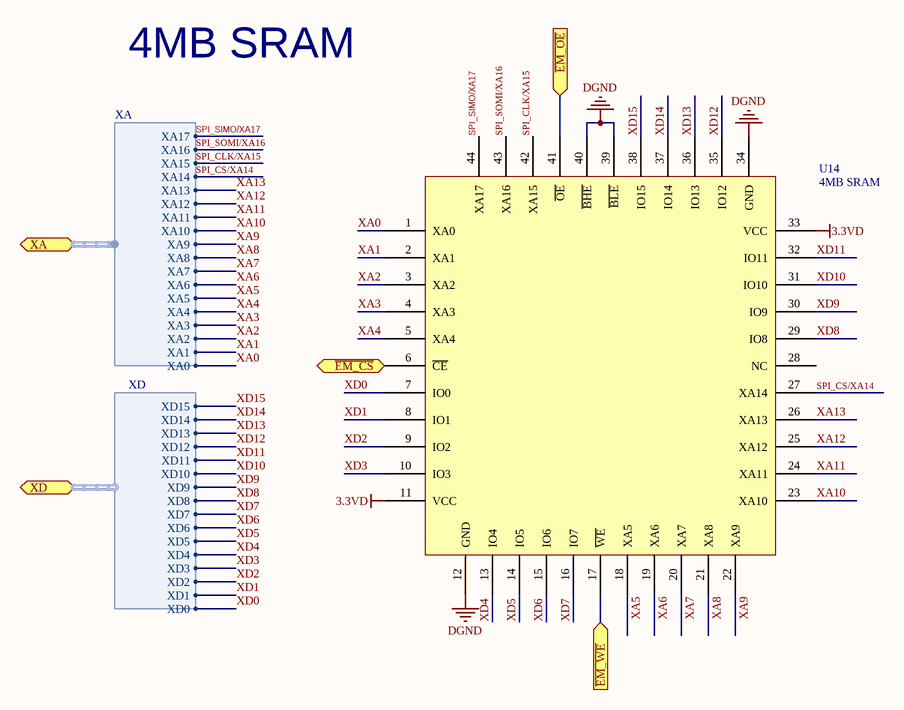
[diagram p7: Digital_SRAM.SchDoc]

### Parts
U14  4MB SRAM  [TSOP-44]

### Ports
XA (harness XA), XD (harness XD), ~{EM_CS} (in), ~{EM_OE} (in), ~{EM_WE} (in)

### Harnesses
XA: XA17, XA16, XA15, XA14, XA13, XA12, XA11, XA10, XA9, XA8, XA7, XA6, XA5, XA4, XA3, XA2, XA1, XA0
XD: XD15, XD14, XD13, XD12, XD11, XD10, XD9, XD8, XD7, XD6, XD5, XD4, XD3, XD2, XD1, XD0

### Nets
3.3VD: U14.11(VCC) U14.33(VCC)
DGND: U14.12(GND) U14.34(GND) U14.39(~{BLE}) U14.40(~{BHE})
~{EM_CS}: U14.6(~{CE}) ; port ~{EM_CS}
~{EM_OE}: U14.41(~{OE}) ; port ~{EM_OE}
~{EM_WE}: U14.17(~{WE}) ; port ~{EM_WE}
SPI_CLK/XA15: U14.42(XA15) ; port XA.XA15
SPI_CS/XA14: U14.27(XA14) ; port XA.XA14
SPI_SIMO/XA17: U14.44(XA17) ; port XA.XA17
SPI_SOMI/XA16: U14.43(XA16) ; port XA.XA16
XA0: U14.1(XA0) ; port XA.XA0
XA1: U14.2(XA1) ; port XA.XA1
XA2: U14.3(XA2) ; port XA.XA2
XA3: U14.4(XA3) ; port XA.XA3
XA4: U14.5(XA4) ; port XA.XA4
XA5: U14.18(XA5) ; port XA.XA5
XA6: U14.19(XA6) ; port XA.XA6
XA7: U14.20(XA7) ; port XA.XA7
XA8: U14.21(XA8) ; port XA.XA8
XA9: U14.22(XA9) ; port XA.XA9
XA10: U14.23(XA10) ; port XA.XA10
XA11: U14.24(XA11) ; port XA.XA11
XA12: U14.25(XA12) ; port XA.XA12
XA13: U14.26(XA13) ; port XA.XA13
XD0: U14.7(IO0) ; port XD.XD0
XD1: U14.8(IO1) ; port XD.XD1
XD2: U14.9(IO2) ; port XD.XD2
XD3: U14.10(IO3) ; port XD.XD3
XD4: U14.13(IO4) ; port XD.XD4
XD5: U14.14(IO5) ; port XD.XD5
XD6: U14.15(IO6) ; port XD.XD6
XD7: U14.16(IO7) ; port XD.XD7
XD8: U14.29(IO8) ; port XD.XD8
XD9: U14.30(IO9) ; port XD.XD9
XD10: U14.31(IO10) ; port XD.XD10
XD11: U14.32(IO11) ; port XD.XD11
XD12: U14.35(IO12) ; port XD.XD12
XD13: U14.36(IO13) ; port XD.XD13
XD14: U14.37(IO14) ; port XD.XD14
XD15: U14.38(IO15) ; port XD.XD15

Not connected (* = marked no-connect by the designer): U14 28(NC)

### Notes on the sheet
- 4MB SRAM

### Library data of the parts
U14 = CY7C1041CV33-8ZSXI: IC SRAM 4MBIT 8NS 44TSOP; Supplier 1: Digi-Key; Supplier Part Number 1: 428-3284-ND

## Sheet Digital_CPLD.SchDoc
size 381 x 381 mm
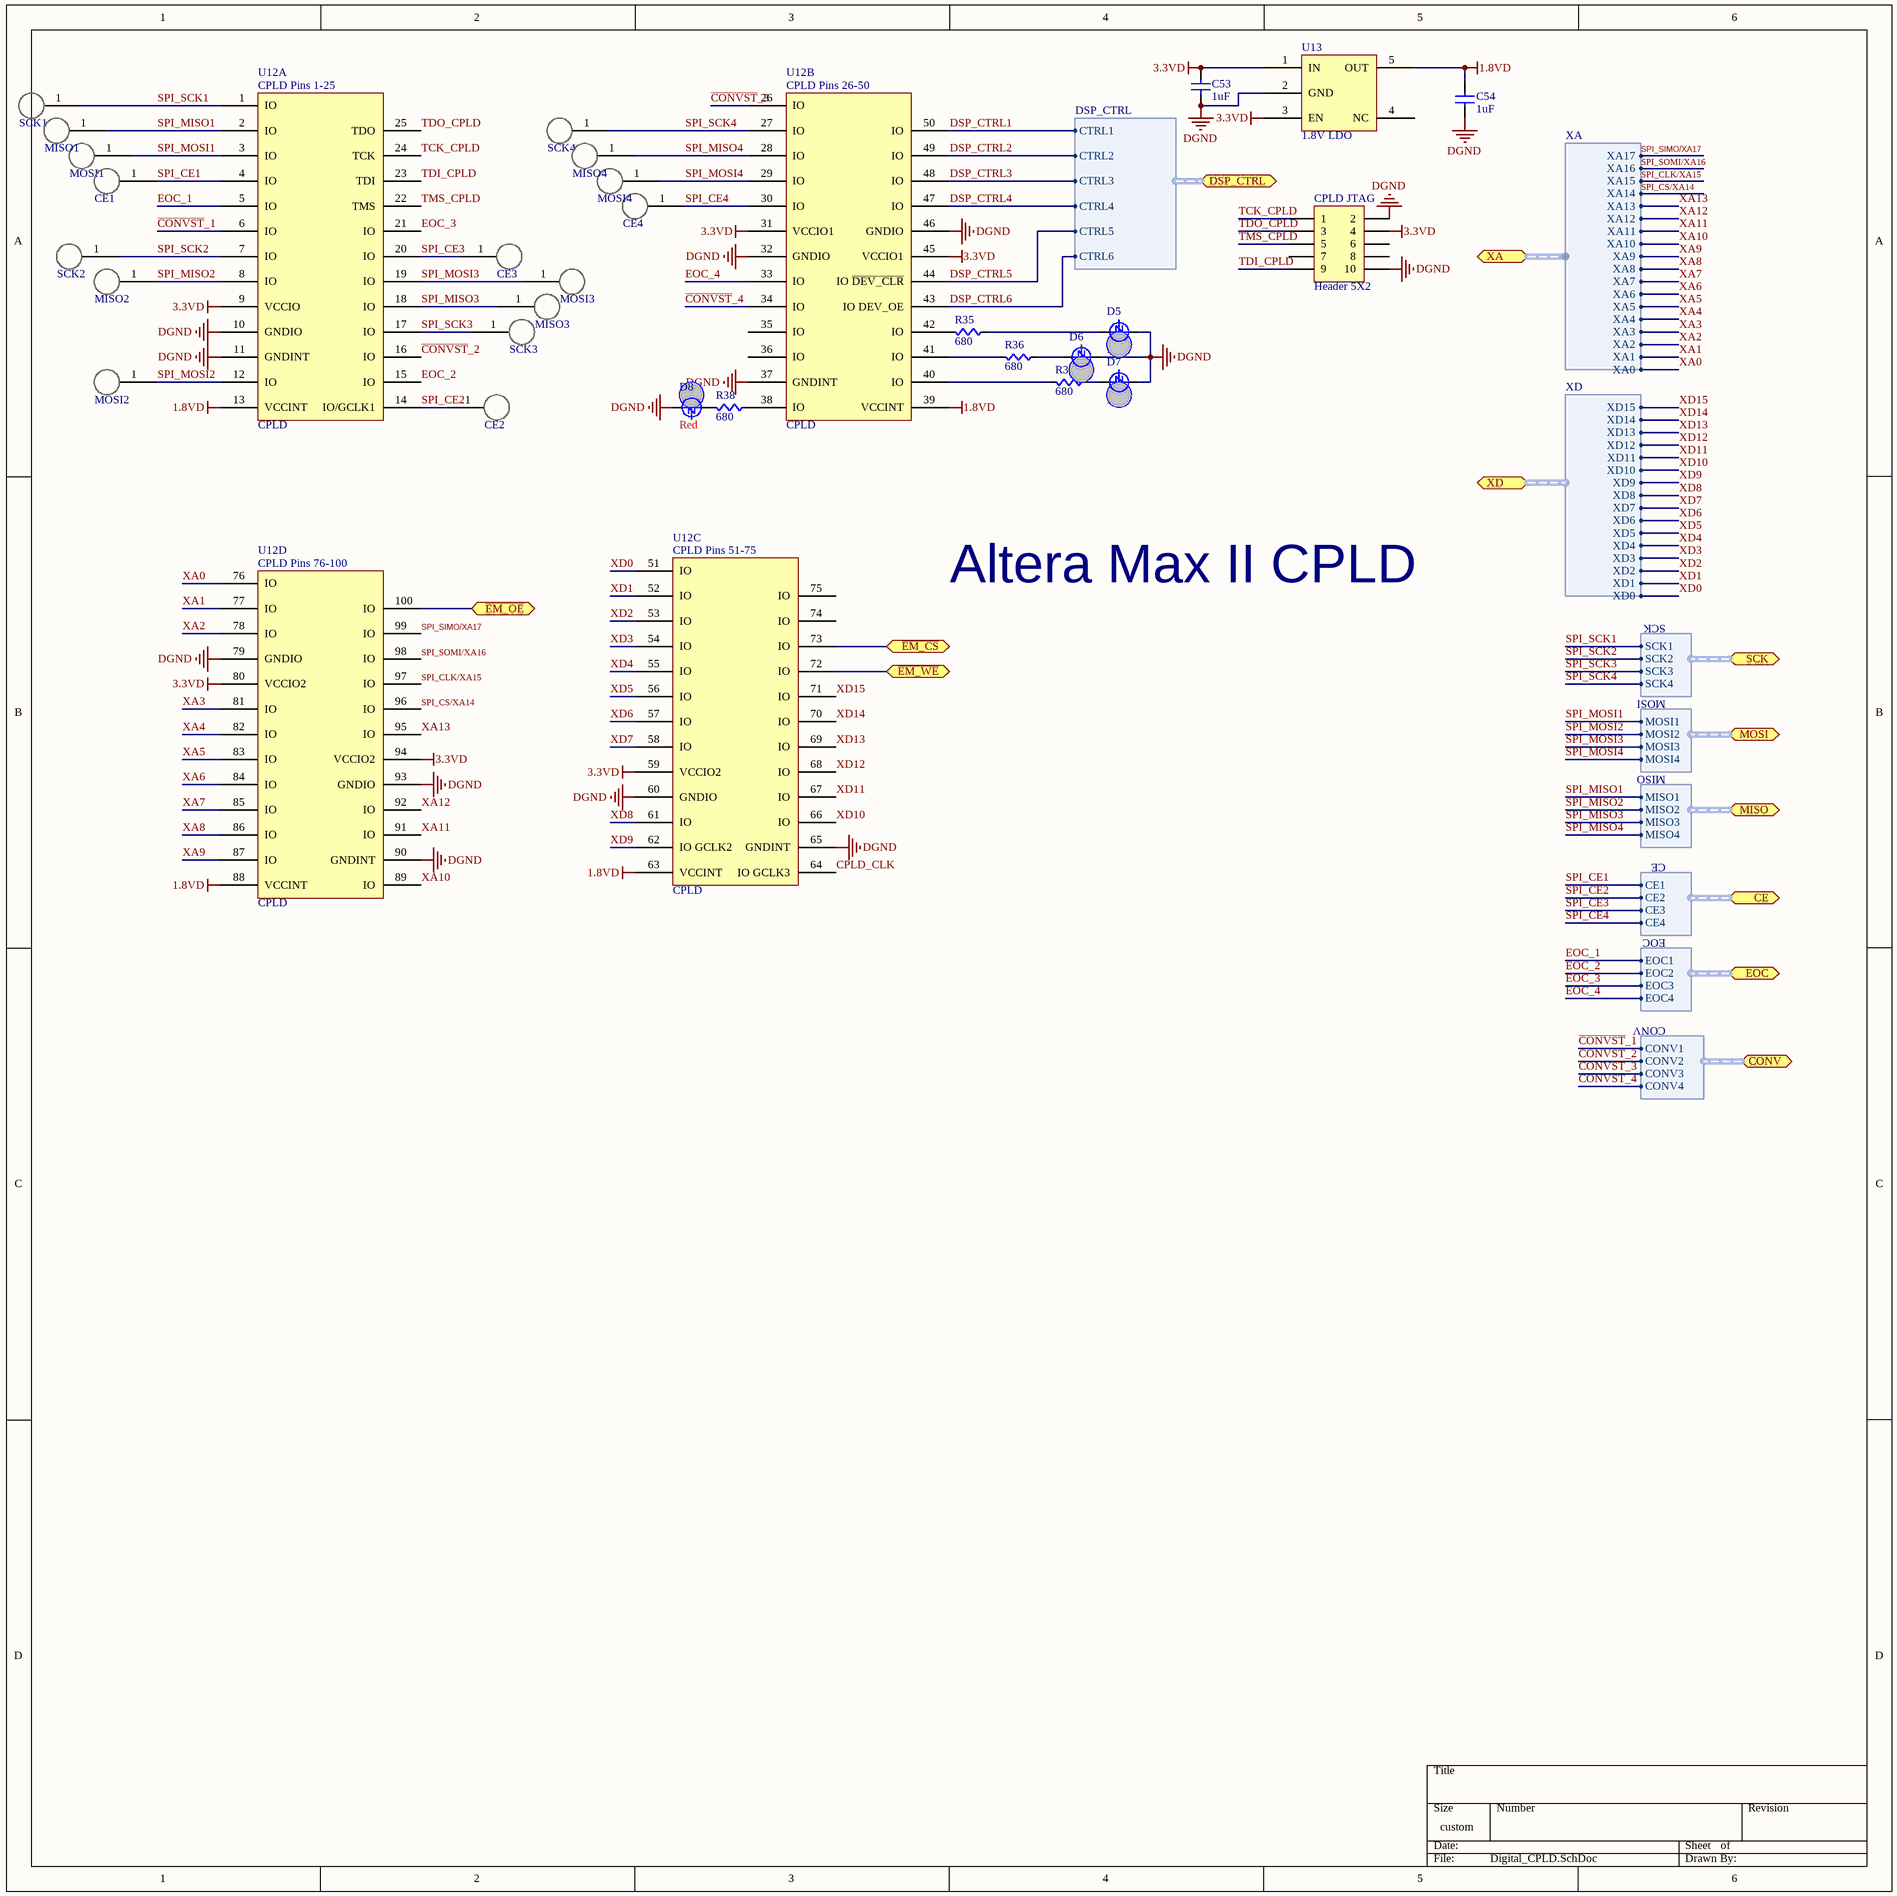
[diagram p8: Digital_CPLD.SchDoc]

### Parts
C53  value 1uF  [CAPC0603]  (hidden comment: Cap)
C54  value 1uF  [CAPC0603]  (hidden comment: Cap)
CE1  Test_Point  [TP]  (value not drawn)
CE2  Test_Point  [TP]  (value not drawn)
CE3  Test_Point  [TP]  (value not drawn)
CE4  Test_Point  [TP]  (value not drawn)
CPLD_JTAG  Header 5X2  [HDR2X5]
D5  Color: Red  [LED0603]  (hidden comment: LED)
D6  Color: Red  [LED0603]  (hidden comment: LED)
D7  Color: Red  [LED0603]  (hidden comment: LED)
D8  Color: Red  [LED0603]  (hidden comment: LED)
MISO1  Test_Point  [TP]  (value not drawn)
MISO2  Test_Point  [TP]  (value not drawn)
MISO3  Test_Point  [TP]  (value not drawn)
MISO4  Test_Point  [TP]  (value not drawn)
MOSI1  Test_Point  [TP]  (value not drawn)
MOSI2  Test_Point  [TP]  (value not drawn)
MOSI3  Test_Point  [TP]  (value not drawn)
MOSI4  Test_Point  [TP]  (value not drawn)
R35  value 680  [RES0603]  (hidden comment: Res)
R36  value 680  [RES0603]  (hidden comment: Res)
R37  value 680  [RES0603]  (hidden comment: Res)
R38  value 680  [RES0603]  (hidden comment: Res)
SCK1  Test_Point  [TP]  (value not drawn)
SCK2  Test_Point  [TP]  (value not drawn)
SCK3  Test_Point  [TP]  (value not drawn)
SCK4  Test_Point  [TP]  (value not drawn)
U12  CPLD  [TQFP-100]  (parts A,B,C,D of 4)
U13  1.8V LDO  [SOT23-5n]

### Ports
CE (harness CE), CONV (harness CONV), DSP_CTRL (harness DSP_CTRL), EOC (harness EOC), MISO (harness MISO), MOSI (harness MOSI), SCK (harness SCK), XA (harness XA), XD (harness XD), ~{EM_CS} (bidir), ~{EM_OE} (bidir), ~{EM_WE} (bidir)

### Harnesses
DSP_CTRL: CTRL1, CTRL2, CTRL3, CTRL4, CTRL5, CTRL6
XA: XA17, XA16, XA15, XA14, XA13, XA12, XA11, XA10, XA9, XA8, XA7, XA6, XA5, XA4, XA3, XA2, XA1, XA0
XD: XD15, XD14, XD13, XD12, XD11, XD10, XD9, XD8, XD7, XD6, XD5, XD4, XD3, XD2, XD1, XD0
CE: CE1, CE2, CE3, CE4
MISO: MISO1, MISO2, MISO3, MISO4
EOC: EOC1, EOC2, EOC3, EOC4
MOSI: MOSI1, MOSI2, MOSI3, MOSI4
SCK: SCK1, SCK2, SCK3, SCK4
CONV: CONV1, CONV2, CONV3, CONV4

### Nets
1.8VD: C54.1(A) U12.13(VCCINT) U12.39(VCCINT) U12.63(VCCINT) U12.88(VCCINT) U13.5(OUT)
3.3VD: C53.1(A) CPLD_JTAG.4 U12.9(VCCIO) U12.31(VCCIO1) U12.45(VCCIO1) U12.59(VCCIO2) U12.80(VCCIO2) U12.94(VCCIO2) U13.1(IN) U13.3(EN)
DGND: C53.2(B) C54.2(B) CPLD_JTAG.2 CPLD_JTAG.10 D5.C D6.C D7.C D8.C U12.10(GNDIO) U12.11(GNDINT) U12.32(GNDIO) U12.37(GNDINT) U12.46(GNDIO) U12.60(GNDIO) U12.65(GNDINT) U12.79(GNDIO) U12.90(GNDINT) U12.93(GNDIO) U13.2(GND)
~{CONVST}_1: U12.6(IO) ; port CONV.CONV1
~{CONVST}_2: U12.16(IO) ; port CONV.CONV2
~{CONVST}_3: U12.26(IO) ; port CONV.CONV3
~{CONVST}_4: U12.34(IO) ; port CONV.CONV4
CPLD_CLK: U12.64(IO_GCLK3)
DSP_CTRL1: U12.50(IO) ; port DSP_CTRL.CTRL1
DSP_CTRL2: U12.49(IO) ; port DSP_CTRL.CTRL2
DSP_CTRL3: U12.48(IO) ; port DSP_CTRL.CTRL3
DSP_CTRL4: U12.47(IO) ; port DSP_CTRL.CTRL4
DSP_CTRL5: U12.44(IO_~{DEV_CLR}) ; port DSP_CTRL.CTRL5
DSP_CTRL6: U12.43(IO_DEV_OE) ; port DSP_CTRL.CTRL6
~{EM_CS}: U12.73(IO) ; port ~{EM_CS}
~{EM_OE}: U12.100(IO) ; port ~{EM_OE}
~{EM_WE}: U12.72(IO) ; port ~{EM_WE}
EOC_1: U12.5(IO) ; port EOC.EOC1
EOC_2: U12.15(IO) ; port EOC.EOC2
EOC_3: U12.21(IO) ; port EOC.EOC3
EOC_4: U12.33(IO) ; port EOC.EOC4
SPI_CE1: CE1.1 U12.4(IO) ; port CE.CE1
SPI_CE2: CE2.1 U12.14(IO/GCLK1) ; port CE.CE2
SPI_CE3: CE3.1 U12.20(IO) ; port CE.CE3
SPI_CE4: CE4.1 U12.30(IO) ; port CE.CE4
SPI_CLK/XA15: U12.97(IO) ; port XA.XA15
SPI_CS/XA14: U12.96(IO) ; port XA.XA14
SPI_MISO1: MISO1.1 U12.2(IO) ; port MISO.MISO1
SPI_MISO2: MISO2.1 U12.8(IO) ; port MISO.MISO2
SPI_MISO3: MISO3.1 U12.18(IO) ; port MISO.MISO3
SPI_MISO4: MISO4.1 U12.28(IO) ; port MISO.MISO4
SPI_MOSI1: MOSI1.1 U12.3(IO) ; port MOSI.MOSI1
SPI_MOSI2: MOSI2.1 U12.12(IO) ; port MOSI.MOSI2
SPI_MOSI3: MOSI3.1 U12.19(IO) ; port MOSI.MOSI3
SPI_MOSI4: MOSI4.1 U12.29(IO) ; port MOSI.MOSI4
SPI_SCK1: SCK1.1 U12.1(IO) ; port SCK.SCK1
SPI_SCK2: SCK2.1 U12.7(IO) ; port SCK.SCK2
SPI_SCK3: SCK3.1 U12.17(IO) ; port SCK.SCK3
SPI_SCK4: SCK4.1 U12.27(IO) ; port SCK.SCK4
SPI_SIMO/XA17: U12.99(IO) ; port XA.XA17
SPI_SOMI/XA16: U12.98(IO) ; port XA.XA16
TCK_CPLD: CPLD_JTAG.1 U12.24(TCK)
TDI_CPLD: CPLD_JTAG.9 U12.23(TDI)
TDO_CPLD: CPLD_JTAG.3 U12.25(TDO)
TMS_CPLD: CPLD_JTAG.5 U12.22(TMS)
XA0: U12.76(IO) ; port XA.XA0
XA1: U12.77(IO) ; port XA.XA1
XA2: U12.78(IO) ; port XA.XA2
XA3: U12.81(IO) ; port XA.XA3
XA4: U12.82(IO) ; port XA.XA4
XA5: U12.83(IO) ; port XA.XA5
XA6: U12.84(IO) ; port XA.XA6
XA7: U12.85(IO) ; port XA.XA7
XA8: U12.86(IO) ; port XA.XA8
XA9: U12.87(IO) ; port XA.XA9
XA10: U12.89(IO) ; port XA.XA10
XA11: U12.91(IO) ; port XA.XA11
XA12: U12.92(IO) ; port XA.XA12
XA13: U12.95(IO) ; port XA.XA13
XD0: U12.51(IO) ; port XD.XD0
XD1: U12.52(IO) ; port XD.XD1
XD2: U12.53(IO) ; port XD.XD2
XD3: U12.54(IO) ; port XD.XD3
XD4: U12.55(IO) ; port XD.XD4
XD5: U12.56(IO) ; port XD.XD5
XD6: U12.57(IO) ; port XD.XD6
XD7: U12.58(IO) ; port XD.XD7
XD8: U12.61(IO) ; port XD.XD8
XD9: U12.62(IO_GCLK2) ; port XD.XD9
XD10: U12.66(IO) ; port XD.XD10
XD11: U12.67(IO) ; port XD.XD11
XD12: U12.68(IO) ; port XD.XD12
XD13: U12.69(IO) ; port XD.XD13
XD14: U12.70(IO) ; port XD.XD14
XD15: U12.71(IO) ; port XD.XD15
NetD5_A: D5.A R35.2(B)
NetD6_A: D6.A R36.2(B)
NetD7_A: D7.A R37.2(B)
NetD8_A: D8.A R38.1(A)
NetR35_1: R35.1(A) U12.42(IO)
NetR36_1: R36.1(A) U12.41(IO)
NetR37_1: R37.1(A) U12.40(IO)
NetR38_2: R38.2(B) U12.38(IO)

Not connected (* = marked no-connect by the designer): CPLD_JTAG 6 7 8; U12 35(IO) 36(IO) 74(IO) 75(IO); U13 4(NC)

### Notes on the sheet
- Altera Max II CPLD
- (in symbol EPM240GT100I5N, part A) CPLD Pins 1-25
- (in symbol EPM240GT100I5N, part B) CPLD Pins 26-50
- (in symbol EPM240GT100I5N, part C) CPLD Pins 51-75
- (in symbol EPM240GT100I5N, part D) CPLD Pins 76-100

### Library data of the parts
CE1-CE4 MISO1-MISO4 MOSI1-MOSI4 SCK1-SCK4 = Test_Point: TEST POINT PC COMPACT .063"D; Supplier 1: Digi-Key; Supplier Part Number 1: 5006K-ND
CPLD_JTAG = Header 5X2: Header, 5-Pin, Dual row; LatestRevisionDate: 17-Jul-2002; LatestRevisionNote: Re-released for DXP Platform.; Publisher: Altium Limited
U12 = EPM240GT100I5N: IC CPLD 192MC 4.7NS 100TQFP; Supplier 1: Digi-Key; Supplier Part Number 1: 544-2275-ND
U13 = LP5907: IC REG LDO 1.8V 0.25A SOT23-5; Supplier 1: Digi-Key; Supplier Part Number 1: 296-41463-2-ND
C53 C54 = Cap: Supplier 1: Digi-Key; Supplier Part Number 1: 1276-1000-1-ND
D5-D8 = LED: Supplier 1: Digi-Key; Supplier Part Number 1: 754-1122-1-ND
R35-R38 = Res: Supplier 1: Digi-Key; Supplier Part Number 1: RMCF0603JT10K0CT-ND

## Nets that join several sheets
1.8VD: Digital_DSPv3 (27 pins), Digital_CPLD (6 pins)
3.3VD: A1 (U2_A1.16), A2 (U2_A2.16), A3 (U2_A3.16), A4 (U2_A4.16), Digital_DSPv3 (42 pins), Digital_SRAM (U14.11 U14.33), Digital_CPLD (10 pins)
5VD: A1 (FB1_A1.1), A2 (FB1_A2.1), A3 (FB1_A3.1), A4 (FB1_A4.1), Power_Supply (5V.2), Digital_DSPv3 (R13.1 U7.13 U8.4)
DGND: A1 (NT1_A1.2 U2_A1.14), A2 (NT1_A2.2 U2_A2.14), A3 (NT1_A3.2 U2_A3.14), A4 (NT1_A4.2 U2_A4.14), Power_Supply (10 pins), Digital_DSPv3 (98 pins), Digital_SRAM (U14.12 U14.34 U14.39 U14.40), Digital_CPLD (19 pins)
AGND: A1 (24 pins), Digital_DSPv3 (U3.21)
AGND: A2 (24 pins), Digital_DSPv3 (U3.1)
AGND: A3 (24 pins), Digital_DSPv3 (U3.17)
AGND: A4 (24 pins), Digital_DSPv3 (U3.5)
~{CONVST}_1: A1 (U2_A1.9), Digital_CPLD (U12.6)
~{CONVST}_2: A2 (U2_A2.9), Digital_CPLD (U12.16)
~{CONVST}_3: A3 (U2_A3.9), Digital_CPLD (U12.26)
~{CONVST}_4: A4 (U2_A4.9), Digital_CPLD (U12.34)
DSP_CTRL1: Digital_DSPv3 (U6.5), Digital_CPLD (U12.50)
DSP_CTRL2: Digital_DSPv3 (U6.6), Digital_CPLD (U12.49)
DSP_CTRL3: Digital_DSPv3 (U6.7), Digital_CPLD (U12.48)
DSP_CTRL4: Digital_DSPv3 (U6.10), Digital_CPLD (U12.47)
DSP_CTRL5: Digital_DSPv3 (U6.11), Digital_CPLD (U12.44)
DSP_CTRL6: Digital_DSPv3 (U6.12), Digital_CPLD (U12.43)
~{EM_CS}: Digital_DSPv3 (U6.150), Digital_SRAM (U14.6), Digital_CPLD (U12.73)
~{EM_OE}: Digital_DSPv3 (U6.149), Digital_SRAM (U14.41), Digital_CPLD (U12.100)
~{EM_WE}: Digital_DSPv3 (U6.137), Digital_SRAM (U14.17), Digital_CPLD (U12.72)
EOC_1: A1 (U2_A1.10), Digital_CPLD (U12.5)
EOC_2: A2 (U2_A2.10), Digital_CPLD (U12.15)
EOC_3: A3 (U2_A3.10), Digital_CPLD (U12.21)
EOC_4: A4 (U2_A4.10), Digital_CPLD (U12.33)
RGA_: A1 (DNP_A1.1 R4_A1.1 U1_A1.1), Digital_DSPv3 (SPI_RES.1)
RGA_: A2 (DNP_A2.1 R4_A2.1 U1_A2.1), Digital_DSPv3 (SPI_RES.5)
RGA_: A3 (DNP_A3.1 R4_A3.1 U1_A3.1), Digital_DSPv3 (SPI_RES.9)
RGA_: A4 (DNP_A4.1 R4_A4.1 U1_A4.1), Digital_DSPv3 (SPI_RES.13)
RGB_: A1 (DNP_A1.2 R16_A1.2 U1_A1.6), Digital_DSPv3 (SPI_RES.3)
RGB_: A2 (DNP_A2.2 R16_A2.2 U1_A2.6), Digital_DSPv3 (SPI_RES.7)
RGB_: A3 (DNP_A3.2 R16_A3.2 U1_A3.6), Digital_DSPv3 (SPI_RES.11)
RGB_: A4 (DNP_A4.2 R16_A4.2 U1_A4.6), Digital_DSPv3 (SPI_RES.15)
SPI_CE1: A1 (U2_A1.11), Digital_CPLD (CE1.1 U12.4)
SPI_CE2: A2 (U2_A2.11), Digital_CPLD (CE2.1 U12.14)
SPI_CE3: A3 (U2_A3.11), Digital_CPLD (CE3.1 U12.20)
SPI_CE4: A4 (U2_A4.11), Digital_CPLD (CE4.1 U12.30)
SPI_CLK/XA15: Digital_DSPv3 (SPI.4 U3.14 U6.62 U7.2), Digital_SRAM (U14.42), Digital_CPLD (U12.97)
SPI_CS/XA14: Digital_DSPv3 (SPI.1 U6.63), Digital_SRAM (U14.27), Digital_CPLD (U12.96)
SPI_MISO1: A1 (U2_A1.13), Digital_CPLD (MISO1.1 U12.2)
SPI_MISO2: A2 (U2_A2.13), Digital_CPLD (MISO2.1 U12.8)
SPI_MISO3: A3 (U2_A3.13), Digital_CPLD (MISO3.1 U12.18)
SPI_MISO4: A4 (U2_A4.13), Digital_CPLD (MISO4.1 U12.28)
SPI_MOSI1: A1 (U2_A1.12), Digital_CPLD (MOSI1.1 U12.3)
SPI_MOSI2: A2 (U2_A2.12), Digital_CPLD (MOSI2.1 U12.12)
SPI_MOSI3: A3 (U2_A3.12), Digital_CPLD (MOSI3.1 U12.19)
SPI_MOSI4: A4 (U2_A4.12), Digital_CPLD (MOSI4.1 U12.29)
SPI_SCK1: A1 (U2_A1.15), Digital_CPLD (SCK1.1 U12.1)
SPI_SCK2: A2 (U2_A2.15), Digital_CPLD (SCK2.1 U12.7)
SPI_SCK3: A3 (U2_A3.15), Digital_CPLD (SCK3.1 U12.17)
SPI_SCK4: A4 (U2_A4.15), Digital_CPLD (SCK4.1 U12.27)
SPI_SIMO/XA17: Digital_DSPv3 (SPI.3 U3.12 U6.27 U7.9), Digital_SRAM (U14.44), Digital_CPLD (U12.99)
SPI_SOMI/XA16: Digital_DSPv3 (SPI.2 U3.13 U6.28 U7.8), Digital_SRAM (U14.43), Digital_CPLD (U12.98)
XA0: Digital_DSPv3 (U6.151), Digital_SRAM (U14.1), Digital_CPLD (U12.76)
XA1: Digital_DSPv3 (U6.152), Digital_SRAM (U14.2), Digital_CPLD (U12.77)
XA2: Digital_DSPv3 (U6.153), Digital_SRAM (U14.3), Digital_CPLD (U12.78)
XA3: Digital_DSPv3 (U6.156), Digital_SRAM (U14.4), Digital_CPLD (U12.81)
XA4: Digital_DSPv3 (U6.157), Digital_SRAM (U14.5), Digital_CPLD (U12.82)
XA5: Digital_DSPv3 (U6.158), Digital_SRAM (U14.18), Digital_CPLD (U12.83)
XA6: Digital_DSPv3 (U6.161), Digital_SRAM (U14.19), Digital_CPLD (U12.84)
XA7: Digital_DSPv3 (U6.162), Digital_SRAM (U14.20), Digital_CPLD (U12.85)
XA8: Digital_DSPv3 (U6.163), Digital_SRAM (U14.21), Digital_CPLD (U12.86)
XA9: Digital_DSPv3 (U6.164), Digital_SRAM (U14.22), Digital_CPLD (U12.87)
XA10: Digital_DSPv3 (U6.165), Digital_SRAM (U14.23), Digital_CPLD (U12.89)
XA11: Digital_DSPv3 (U6.168), Digital_SRAM (U14.24), Digital_CPLD (U12.91)
XA12: Digital_DSPv3 (R18.1 U6.169), Digital_SRAM (U14.25), Digital_CPLD (U12.92)
XA13: Digital_DSPv3 (R18.2 U6.172), Digital_SRAM (U14.26), Digital_CPLD (U12.95)
XD0: Digital_DSPv3 (U6.136), Digital_SRAM (U14.7), Digital_CPLD (U12.51)
XD1: Digital_DSPv3 (U6.135), Digital_SRAM (U14.8), Digital_CPLD (U12.52)
XD2: Digital_DSPv3 (U6.134), Digital_SRAM (U14.9), Digital_CPLD (U12.53)
XD3: Digital_DSPv3 (U6.133), Digital_SRAM (U14.10), Digital_CPLD (U12.54)
XD4: Digital_DSPv3 (U6.132), Digital_SRAM (U14.13), Digital_CPLD (U12.55)
XD5: Digital_DSPv3 (U6.131), Digital_SRAM (U14.14), Digital_CPLD (U12.56)
XD6: Digital_DSPv3 (U6.130), Digital_SRAM (U14.15), Digital_CPLD (U12.57)
XD7: Digital_DSPv3 (U6.129), Digital_SRAM (U14.16), Digital_CPLD (U12.58)
XD8: Digital_DSPv3 (U6.128), Digital_SRAM (U14.29), Digital_CPLD (U12.61)
XD9: Digital_DSPv3 (U6.127), Digital_SRAM (U14.30), Digital_CPLD (U12.62)
XD10: Digital_DSPv3 (U6.124), Digital_SRAM (U14.31), Digital_CPLD (U12.66)
XD11: Digital_DSPv3 (U6.123), Digital_SRAM (U14.32), Digital_CPLD (U12.67)
XD12: Digital_DSPv3 (U6.122), Digital_SRAM (U14.35), Digital_CPLD (U12.68)
XD13: Digital_DSPv3 (U6.119), Digital_SRAM (U14.36), Digital_CPLD (U12.69)
XD14: Digital_DSPv3 (U6.116), Digital_SRAM (U14.37), Digital_CPLD (U12.70)
XD15: Digital_DSPv3 (U6.115), Digital_SRAM (U14.38), Digital_CPLD (U12.71)